# EAGLE design 2021-01-21_HALO_Main_Board-Autorouted (EAGLE 9.6.2)
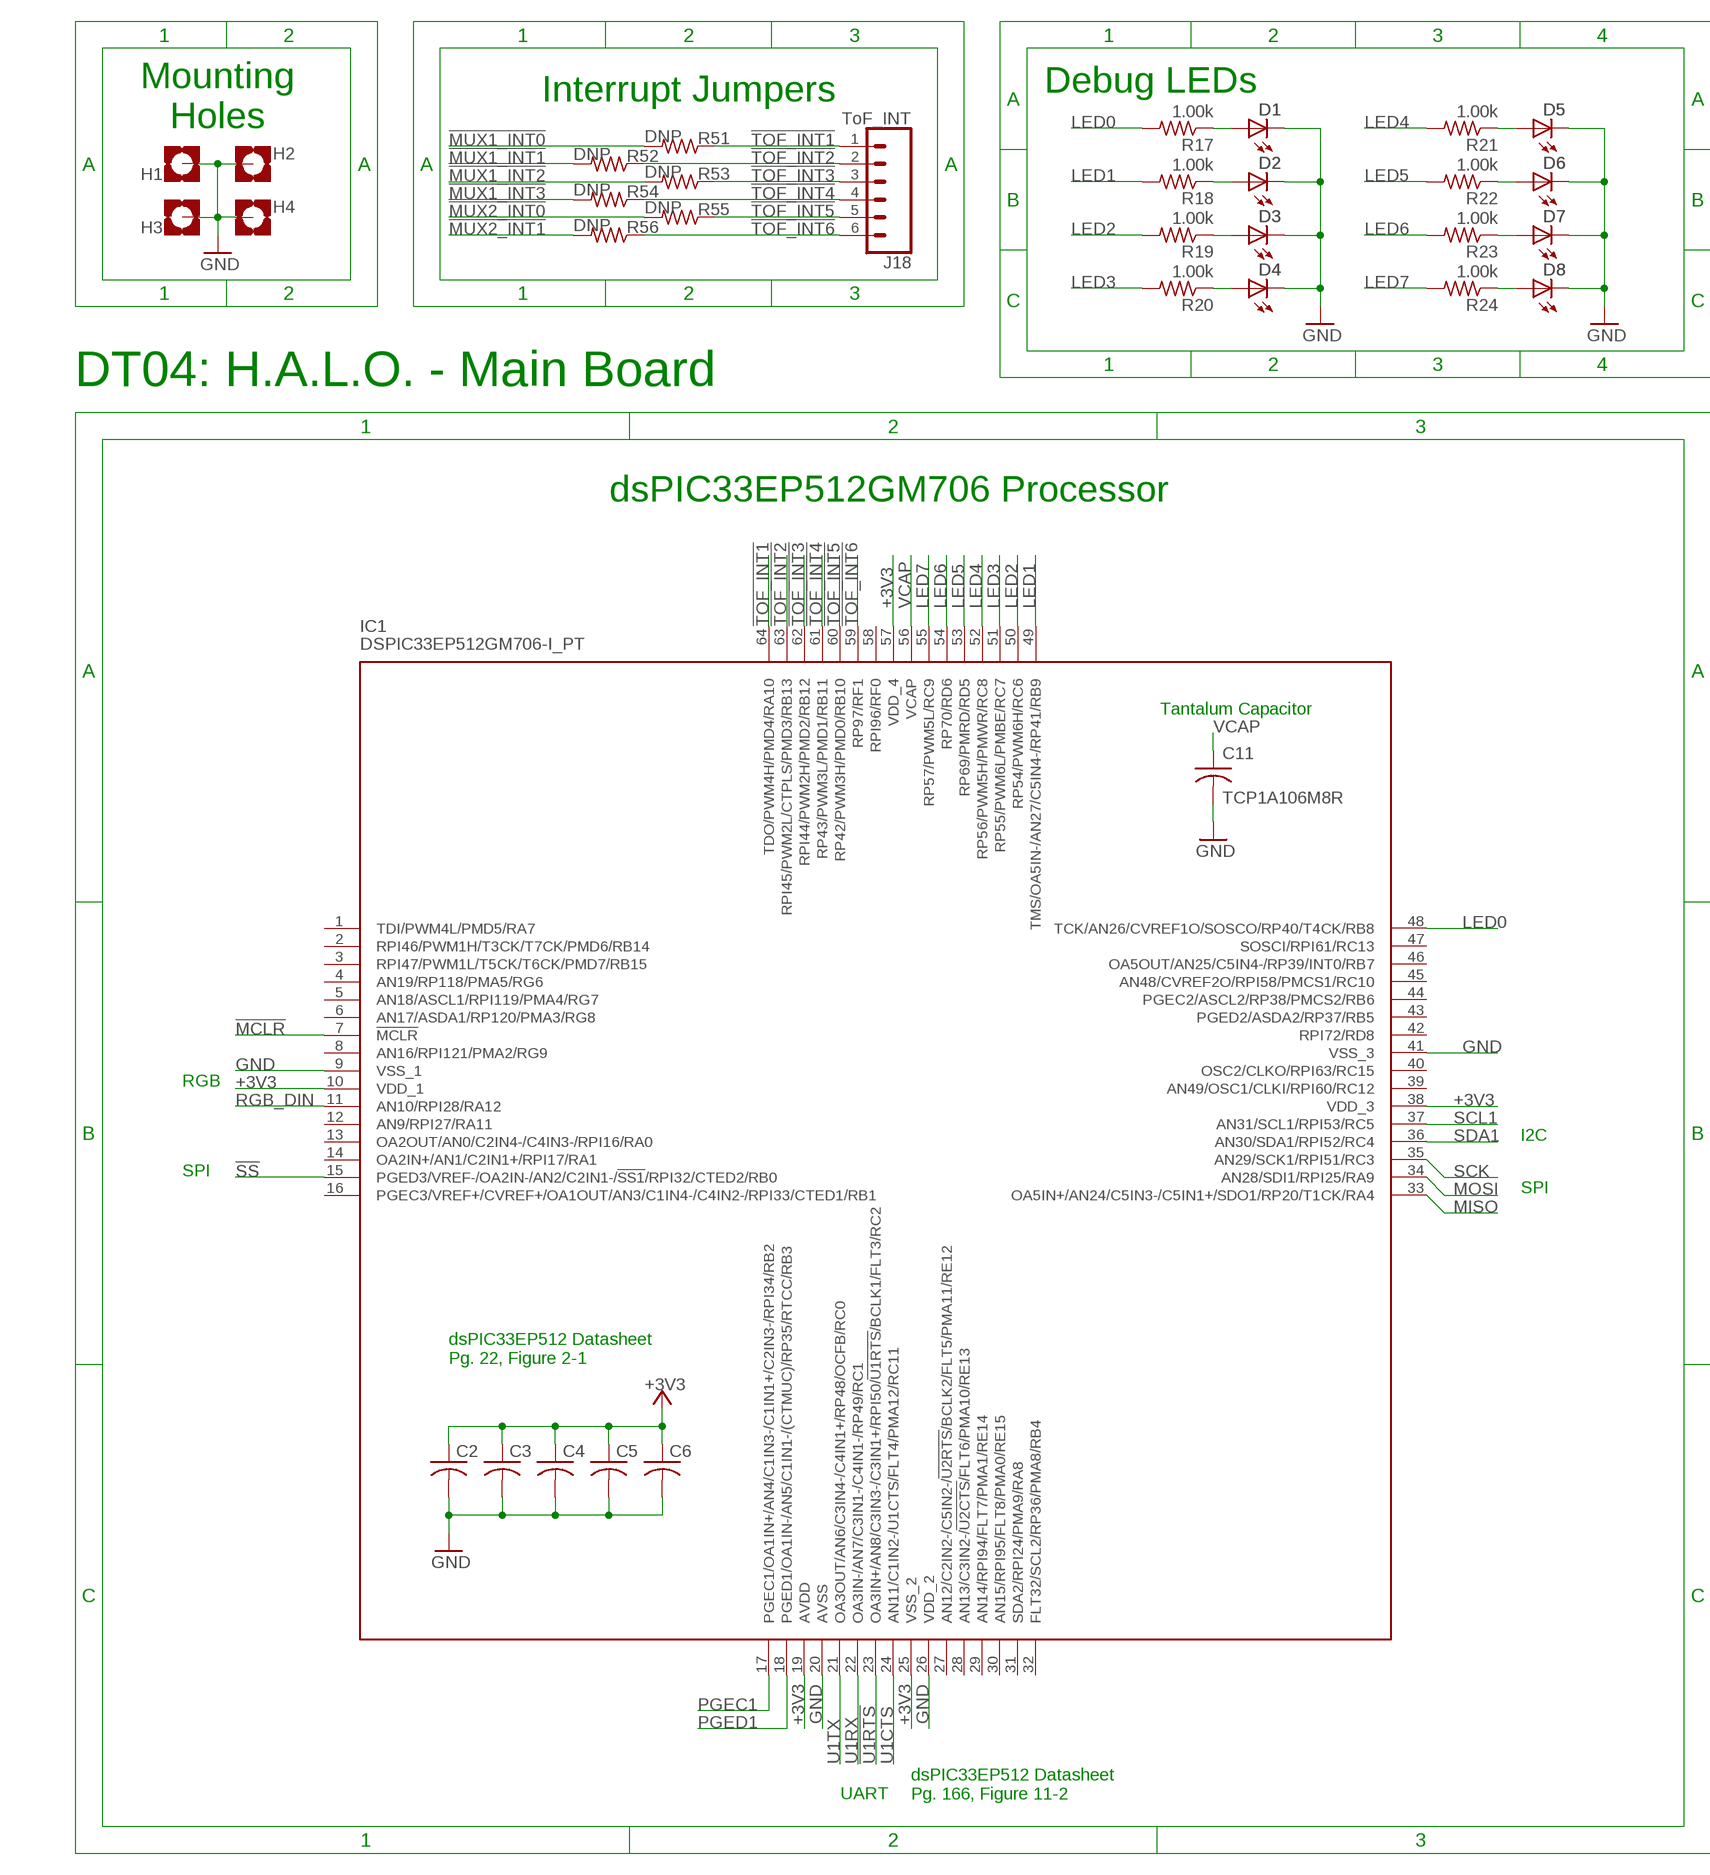
[diagram p0: schematic, sheet 1, part 1 of 2]
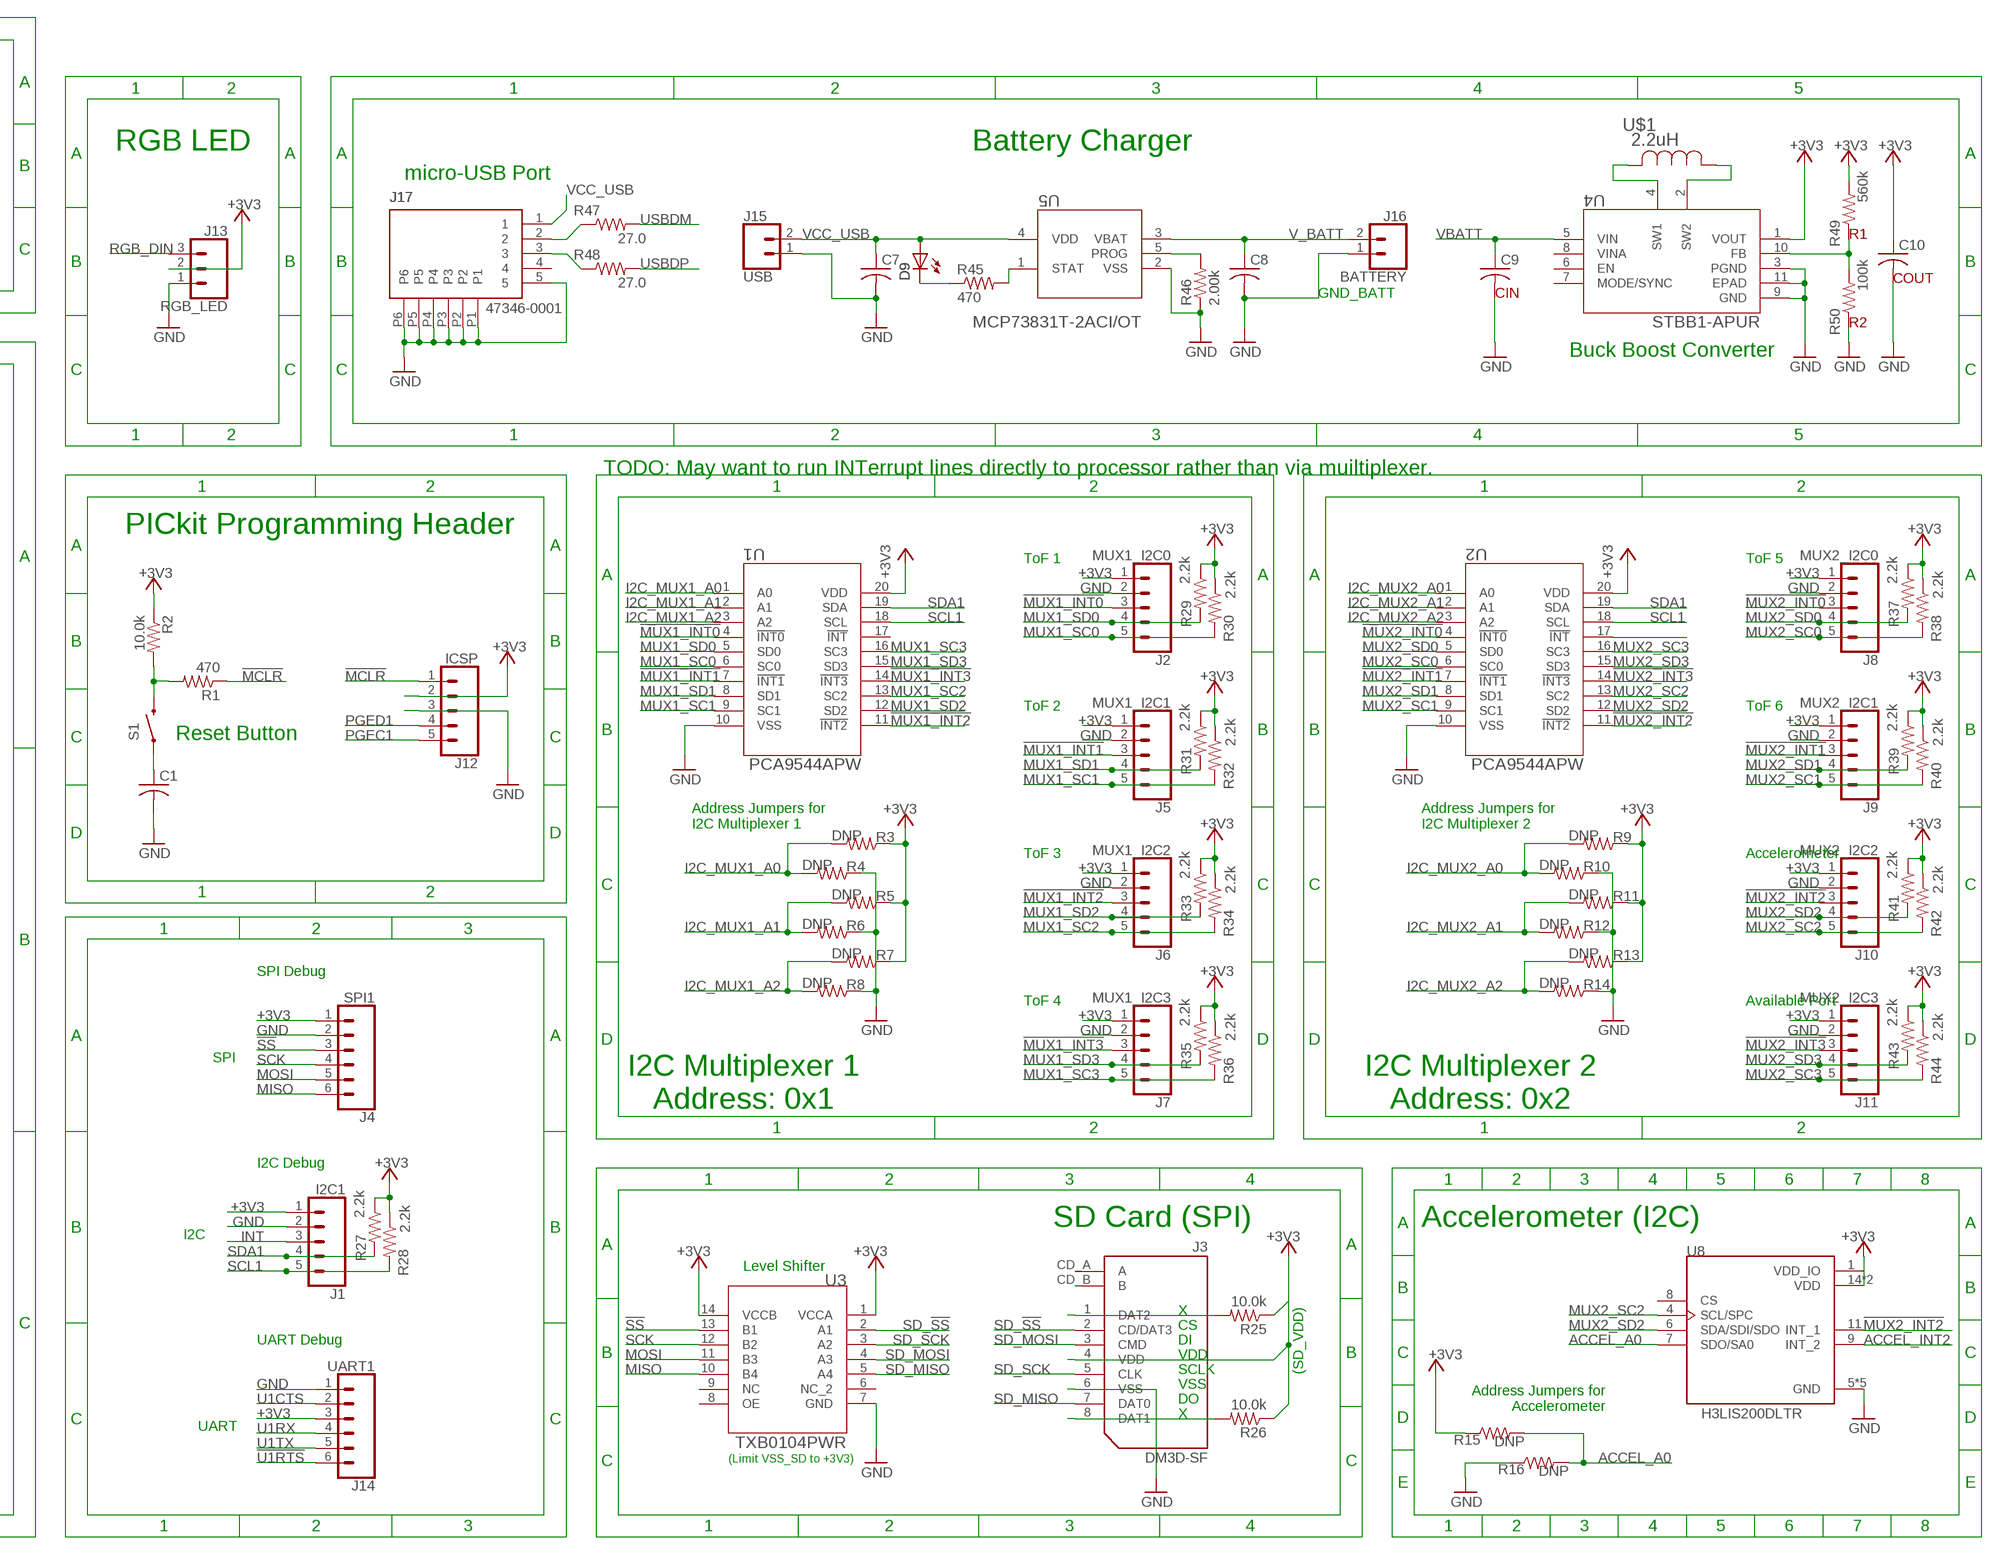
[diagram p1: schematic, sheet 1, part 2 of 2]

## Parts
C1  0.1uF  C-USC0805  [C0805]
C2  0.1uF  C-USC0805  [C0805]
C3  0.1uF  C-USC0805  [C0805]
C4  0.1uF  C-USC0805  [C0805]
C5  0.1uF  C-USC0805  [C0805]
C6  0.1uF  C-USC0805  [C0805]
C7  4.7uF  C-USC0805  [C0805]
C8  4.7uF  C-USC0805  [C0805]
C9  10uF  C-USC0805  [C0805]
C10  22uF  C-USC0805  [C0805]
C11  TCP1A106M8R  [TCP_ROM]
D1  CHIP-LED0805  [CHIP-LED0805]
D2  CHIP-LED0805  [CHIP-LED0805]
D3  CHIP-LED0805  [CHIP-LED0805]
D4  CHIP-LED0805  [CHIP-LED0805]
D5  CHIP-LED0805  [CHIP-LED0805]
D6  CHIP-LED0805  [CHIP-LED0805]
D7  CHIP-LED0805  [CHIP-LED0805]
D8  CHIP-LED0805  [CHIP-LED0805]
D9  CHIP-LED0805  [CHIP-LED0805]
H1  MOUNT-PAD-SQUARE3.0  [3,0-PAD-SQUARE]
H2  MOUNT-PAD-SQUARE3.0  [3,0-PAD-SQUARE]
H3  MOUNT-PAD-SQUARE3.0  [3,0-PAD-SQUARE]
H4  MOUNT-PAD-SQUARE3.0  [3,0-PAD-SQUARE]
IC1  DSPIC33EP512GM706-I_PT  [QFP50P1200X1200X120-64N]
J1  I2C1  CONN_05  [1X05]
J2  MUX1_I2C0  CONN_05  [1X05]
J3  DM3D-SF  AS-ITM-00047  [SD_CARD]
J4  SPI1  CONN_06SILK_FEMALE_PTH  [1X06]
J5  MUX1_I2C1  CONN_05  [1X05]
J6  MUX1_I2C2  CONN_05  [1X05]
J7  MUX1_I2C3  CONN_05  [1X05]
J8  MUX2_I2C0  CONN_05  [1X05]
J9  MUX2_I2C1  CONN_05  [1X05]
J10  MUX2_I2C2  CONN_05  [1X05]
J11  MUX2_I2C3  CONN_05  [1X05]
J12  ICSP  CONN_05  [1X05]
J13  RGB_LED  CONN_03LOCK  [1X03_LOCK]
J14  UART1  CONN_06SILK_FEMALE_PTH  [1X06]
J15  USB  CONN_02  [1X02]
J16  BATTERY  CONN_02  [1X02]
J17  47346-0001  AS-ITM-00021  [MICRO_USB]
J18  ToF_INT  CONN_06SILK_FEMALE_PTH  [1X06]
R1  470  R-US_R0805  [R0805]
R2  10.0k  R-US_R0805  [R0805]
R3  DNP  R-US_R0805  [R0805]
R4  DNP  R-US_R0805  [R0805]
R5  DNP  R-US_R0805  [R0805]
R6  DNP  R-US_R0805  [R0805]
R7  DNP  R-US_R0805  [R0805]
R8  DNP  R-US_R0805  [R0805]
R9  DNP  R-US_R0805  [R0805]
R10  DNP  R-US_R0805  [R0805]
R11  DNP  R-US_R0805  [R0805]
R12  DNP  R-US_R0805  [R0805]
R13  DNP  R-US_R0805  [R0805]
R14  DNP  R-US_R0805  [R0805]
R15  DNP  R-US_R0805  [R0805]
R16  DNP  R-US_R0805  [R0805]
R17  1.00k  R-US_R0805  [R0805]
R18  1.00k  R-US_R0805  [R0805]
R19  1.00k  R-US_R0805  [R0805]
R20  1.00k  R-US_R0805  [R0805]
R21  1.00k  R-US_R0805  [R0805]
R22  1.00k  R-US_R0805  [R0805]
R23  1.00k  R-US_R0805  [R0805]
R24  1.00k  R-US_R0805  [R0805]
R25  10.0k  R-US_R0805  [R0805]
R26  10.0k  R-US_R0805  [R0805]
R27  2.2k  R-US_R0805  [R0805]
R28  2.2k  R-US_R0805  [R0805]
R29  2.2k  R-US_R0805  [R0805]
R30  2.2k  R-US_R0805  [R0805]
R31  2.2k  R-US_R0805  [R0805]
R32  2.2k  R-US_R0805  [R0805]
R33  2.2k  R-US_R0805  [R0805]
R34  2.2k  R-US_R0805  [R0805]
R35  2.2k  R-US_R0805  [R0805]
R36  2.2k  R-US_R0805  [R0805]
R37  2.2k  R-US_R0805  [R0805]
R38  2.2k  R-US_R0805  [R0805]
R39  2.2k  R-US_R0805  [R0805]
R40  2.2k  R-US_R0805  [R0805]
R41  2.2k  R-US_R0805  [R0805]
R42  2.2k  R-US_R0805  [R0805]
R43  2.2k  R-US_R0805  [R0805]
R44  2.2k  R-US_R0805  [R0805]
R45  470  R-US_R0805  [R0805]
R46  2.00k  R-US_R0805  [R0805]
R47  27.0  R-US_R0805  [R0805]
R48  27.0  R-US_R0805  [R0805]
R49  560k  R-US_R0805  [R0805]
R50  100k  R-US_R0805  [R0805]
R51  DNP  R-US_R0805  [R0805]
R52  DNP  R-US_R0805  [R0805]
R53  DNP  R-US_R0805  [R0805]
R54  DNP  R-US_R0805  [R0805]
R55  DNP  R-US_R0805  [R0805]
R56  DNP  R-US_R0805  [R0805]
S1  SWITCH-MOMENTARY-2SMD-4  [TACTILE_SWITCH_TALL]
U1  PCA9544APW  [SOT360-1_NXP]
U2  PCA9544APW  [SOT360-1_NXP]
U3  TXB0104PWR  [PW14]
U4  STBB1-APUR  [SON_B1-APUR_STM]
U5  MCP73831T-2ACI/OT  [SOT-23-5_MC_MCH]
U8  H3LIS200DLTR  [PQFN50P300X300X100-16N]
U$1  2.2uH  IND  [IND_4028_TDK]

## Nets
!MCLR: IC1.7(!MCLR) J12.1 R1.1
!MUX1_INT0: J2.3 R51.2 U1.4(!INT0)
!MUX1_INT1: J5.3 R52.2 U1.7(!INT1)
!MUX1_INT2: J6.3 R53.2 U1.11(!INT2)
!MUX1_INT3: J7.3 R54.2 U1.14(!INT3)
!MUX2_INT0: J8.3 R55.2 U2.4(!INT0)
!MUX2_INT1: J9.3 R56.2 U2.7(!INT1)
!MUX2_INT2: J10.3 U2.11(!INT2) U8.11(INT_1)
!MUX2_INT3: J11.3 U2.14(!INT3)
!SS: IC1.15(PGED3/VREF-/OA2IN-/AN2/C2IN1-/!SS1!/RPI32/CTED2/RB0) J4.3 U3.13(B1)
!TOF_INT1: IC1.64(TDO/PWM4H/PMD4/RA10) J18.1 R51.1
!TOF_INT2: IC1.63(RPI45/PWM2L/CTPLS/PMD3/RB13) J18.2 R52.1
!TOF_INT3: IC1.62(RPI44/PWM2H/PMD2/RB12) J18.3 R53.1
!TOF_INT4: IC1.61(RP43/PWM3L/PMD1/RB11) J18.4 R54.1
!TOF_INT5: IC1.60(RP42/PWM3H/PMD0/RB10) J18.5 R55.1
!TOF_INT6: IC1.59(RP97/RF1) J18.6 R56.1
!U1RTS: IC1.23(OA3IN+/AN8/C3IN3-/C3IN1+/RPI50/!U1RTS!/BCLK1/FLT3/RC2) J14.6
+3V3: C2.1 C3.1 C4.1 C5.1 C6.1 C10.1 IC1.10(VDD_1) IC1.19(AVDD) IC1.25(VSS_2) IC1.38(VDD_3) IC1.57(VDD_4) J1.1 J2.1 J3.4(VDD) J4.1 J5.1 J6.1 J7.1 J8.1 J9.1 J10.1 J11.1 J12.2 J13.2 J14.3 R2.1 R3.1 R5.1 R7.1 R9.1 R11.1 R13.1 R15.1 R25.1 R26.1 R27.1 R28.1 R29.1 R30.1 R31.1 R32.1 R33.1 R34.1 R35.1 R36.1 R37.1 R38.1 R39.1 R40.1 R41.1 R42.1 R43.1 R44.1 R49.2 U1.20(VDD) U2.20(VDD) U3.1(VCCA) U3.14(VCCB) U4.1(VOUT) U8.1(VDD_IO) U8.14(VDD) U8.15(VDD)
ACCEL_A0: R15.2 R16.2 U8.7(SDO/SA0)
ACCEL_INT2: U8.9(INT_2)
GND: C1.2 C2.2 C3.2 C4.2 C5.2 C6.2 C7.2 C8.2 C9.2 C10.2 C11.2 D1.C D2.C D3.C D4.C D5.C D6.C D7.C D8.C H1.B3,0(MOUNT) H2.B3,0(MOUNT) H3.B3,0(MOUNT) H4.B3,0(MOUNT) IC1.9(VSS_1) IC1.20(AVSS) IC1.26(VDD_2) IC1.41(VSS_3) J1.2 J2.2 J3.6(VSS) J4.2 J5.2 J6.2 J7.2 J8.2 J9.2 J10.2 J11.2 J12.3 J13.1 J14.1 J15.1 J16.1 J17.5 J17.P1 J17.P2 J17.P3 J17.P4 J17.P5 J17.P6 R4.1 R6.1 R8.1 R10.1 R12.1 R14.1 R16.1 R46.1 R50.1 U1.10(VSS) U2.10(VSS) U3.7(GND) U4.3(PGND) U4.9(GND) U4.11(EPAD) U5.2(VSS) U8.5(GND) U8.10(GND) U8.12(GND) U8.13(GND) U8.16(GND)
I2C_MUX1_A0: R3.2 R4.2 U1.1(A0)
I2C_MUX1_A1: R5.2 R6.2 U1.2(A1)
I2C_MUX1_A2: R7.2 R8.2 U1.3(A2)
I2C_MUX2_A0: R9.2 R10.2 U2.1(A0)
I2C_MUX2_A1: R11.2 R12.2 U2.2(A1)
I2C_MUX2_A2: R13.2 R14.2 U2.3(A2)
INT: J1.3
LED0: IC1.48(TCK/AN26/CVREF1O/SOSCO/RP40/T4CK/RB8) R17.2
LED1: IC1.49(TMS/OA5IN-/AN27/C5IN4-/RP41/RB9) R18.2
LED2: IC1.50(RP54/PWM6H/RC6) R19.2
LED3: IC1.51(RP55/PWM6L/PMBE/RC7) R20.2
LED4: IC1.52(RP56/PWM5H/PMWR/RC8) R21.2
LED5: IC1.53(RP69/PMRD/RD5) R22.2
LED6: IC1.54(RP70/RD6) R23.2
LED7: IC1.55(RP57/PWM5L/RC9) R24.2
MISO: IC1.33(OA5IN+/AN24/C5IN3-/C5IN1+/SDO1/RP20/T1CK/RA4) J4.6 U3.10(B4)
MOSI: IC1.34(AN28/SDI1/RPI25/RA9) J4.5 U3.11(B3)
MUX1_SC0: J2.5 R30.2 U1.6(SC0)
MUX1_SC1: J5.5 R32.2 U1.9(SC1)
MUX1_SC2: J6.5 R34.2 U1.13(SC2)
MUX1_SC3: J7.5 R36.2 U1.16(SC3)
MUX1_SD0: J2.4 R29.2 U1.5(SD0)
MUX1_SD1: J5.4 R31.2 U1.8(SD1)
MUX1_SD2: J6.4 R33.2 U1.12(SD2)
MUX1_SD3: J7.4 R35.2 U1.15(SD3)
MUX2_SC0: J8.5 R38.2 U2.6(SC0)
MUX2_SC1: J9.5 R40.2 U2.9(SC1)
MUX2_SC2: J10.5 R42.2 U2.13(SC2) U8.4(SCL/SPC)
MUX2_SC3: J11.5 R44.2 U2.16(SC3)
MUX2_SD0: J8.4 R37.2 U2.5(SD0)
MUX2_SD1: J9.4 R39.2 U2.8(SD1)
MUX2_SD2: J10.4 R41.2 U2.12(SD2) U8.6(SDA/SDI/SDO)
MUX2_SD3: J11.4 R43.2 U2.15(SD3)
N$1: R1.2 R2.2 S1.B2
N$2: C1.1 S1.A2
N$3: J3.8(DAT1) R26.2
N$4: J3.1(DAT2) R25.2
N$5: D1.A R17.1
N$6: J17.2 R47.1
N$7: D2.A R18.1
N$8: D9.C R45.1
N$9: R49.1 R50.2 U4.10(FB)
N$10: D3.A R19.1
N$11: D4.A R20.1
N$12: D5.A R21.1
N$13: D6.A R22.1
N$14: D7.A R23.1
N$15: D8.A R24.1
N$16: R45.2 U5.1(STAT)
N$17: J17.3 R48.1
N$18: U4.4(SW1) U$1.2
N$19: R46.2 U5.5(PROG)
N$20: U4.2(SW2) U$1.1
N$25: U2.17(!INT)
PGEC1: IC1.17(PGEC1/OA1IN+/AN4/C1IN3-/C1IN1+/C2IN3-/RPI34/RB2) J12.5
PGED1: IC1.18(PGED1/OA1IN-/AN5/C1IN1-/(CTMUC)/RP35/RTCC/RB3) J12.4
RGB_DIN: IC1.11(AN10/RPI28/RA12) J13.3
SCK: IC1.35(AN29/SCK1/RPI51/RC3) J4.4 U3.12(B2)
SCL1: IC1.37(AN31/SCL1/RPI53/RC5) J1.5 R28.2 U1.18(SCL) U2.18(SCL)
SD_!SS: J3.2(CD/DAT3) U3.2(A1)
SD_MISO: J3.7(DAT0) U3.5(A4)
SD_MOSI: J3.3(CMD) U3.4(A3)
SD_SCK: J3.5(CLK) U3.3(A2)
SDA1: IC1.36(AN30/SDA1/RPI52/RC4) J1.4 R27.2 U1.19(SDA) U2.19(SDA)
U1CTS: IC1.24(AN11/C1IN2-/U1CTS/FLT4/PMA12/RC11) J14.2
U1RX: IC1.22(OA3IN-/AN7/C3IN1-/C4IN1-/RP49/RC1) J14.4
U1TX: IC1.21(OA3OUT/AN6/C3IN4-/C4IN1+/RP48/OCFB/RC0) J14.5
USBDM: R47.2
USBDP: R48.2
V_BATT: C8.1 J16.2 U5.3(VBAT)
VBATT: C9.1 U4.5(VIN)
VCAP: C11.1 IC1.56(VCAP)
VCC_USB: C7.1 D9.A J15.2 J17.1 U5.4(VDD)
Unconnected: IC1.1(TDI/PWM4L/PMD5/RA7) IC1.2(RPI46/PWM1H/T3CK/T7CK/PMD6/RB14) IC1.3(RPI47/PWM1L/T5CK/T6CK/PMD7/RB15) IC1.4(AN19/RP118/PMA5/RG6) IC1.5(AN18/ASCL1/RPI119/PMA4/RG7) IC1.6(AN17/ASDA1/RP120/PMA3/RG8) IC1.8(AN16/RPI121/PMA2/RG9) IC1.12(AN9/RPI27/RA11) IC1.13(OA2OUT/AN0/C2IN4-/C4IN3-/RPI16/RA0) IC1.14(OA2IN+/AN1/C2IN1+/RPI17/RA1) IC1.16(PGEC3/VREF+/CVREF+/OA1OUT/AN3/C1IN4-/C4IN2-/RPI33/CTED1/RB1) IC1.27(AN12/C2IN2-/C5IN2-/!U2RTS!/BCLK2/FLT5/PMA11/RE12) IC1.28(AN13/C3IN2-/!U2CTS!/FLT6/PMA10/RE13) IC1.29(AN14/RPI94/FLT7/PMA1/RE14) IC1.30(AN15/RPI95/FLT8/PMA0/RE15) IC1.31(SDA2/RPI24/PMA9/RA8) IC1.32(FLT32/SCL2/RP36/PMA8/RB4) IC1.39(AN49/OSC1/CLKI/RPI60/RC12) IC1.40(OSC2/CLKO/RPI63/RC15) IC1.42(RPI72/RD8) IC1.43(PGED2/ASDA2/RP37/RB5) IC1.44(PGEC2/ASCL2/RP38/PMCS2/RB6) IC1.45(AN48/CVREF2O/RPI58/PMCS1/RC10) IC1.46(OA5OUT/AN25/C5IN4-/RP39/INT0/RB7) IC1.47(SOSCI/RPI61/RC13) IC1.58(RPI96/RF0) J3.CD_A(A) J3.CD_B(B) J17.4 U1.17(!INT) U3.6(NC_2) U3.8(OE) U3.9(NC) U4.6(EN) U4.7(MODE/SYNC) U8.8(CS)

## Notes on the sheet
- Interrupt Jumpers | Debug LEDs
- Mounting
  Holes
- RGB LED | Battery Charger
- micro-USB Port
- R1
- COUT
- GND_BATT | CIN
- DT04: H.A.L.O. - Main Board
- R2
- Buck Boost Converter
- dsPIC33EP512GM706 Processor
- TODO: May want to run INTerrupt lines directly to processor rather than via muiltiplexer.
- PICkit Programming Header
- ToF 1 | ToF 5
- Tantalum Capacitor
- ToF 2 | ToF 6
- Reset Button
- Address Jumpers for
  I2C Multiplexer 1
- Address Jumpers for
  I2C Multiplexer 2
- ToF 3 | Accelerometer
- ┏ 
  RGB
       ┃
       ┗
- ┓ 
   I2C
  ┛
- SPI Debug
- ┏ 
  SPI
     ┗
- ToF 4 | Available Port
- ┓ 
   SPI
  ┃ 
  ┛
- ┏ 
     ┃
     ┃
  SPI
     ┃
     ┃
     ┗
- I2C Multiplexer 1
  Address: 0x1
- I2C Multiplexer 2
  Address: 0x2
- dsPIC33EP512 Datasheet
  Pg. 22, Figure 2-1
- I2C Debug
- SD Card (SPI) | Accelerometer (I2C)
- Level Shifter
- ┏ 
     ┃
  I2C
     ┃
     ┃
     ┗
- X
- CS
- UART Debug | DI
- VDD
- SCLK | (SD_VDD)
- VSS
- DO
- Address Jumpers for
  Accelerometer
- X
- (Limit VSS_SD to +3V3)
- ┏ 
        ┃
        ┃
  UART
        ┃
        ┃
        ┗
- ┗ UART┛
- dsPIC33EP512 Datasheet
  Pg. 166, Figure 11-2

## Power pins joined to a net without a drawn wire
VINA: U4.8(VINA)

## Library data of the parts
C1-C10 = rcl:C-US: CAPACITOR, American symbol
C11 = HALO_Tant_Cap_Library:TCP1A106M8R; BUILT_BY: EMA_UL_Team; MANUFACTURER_PART_NUMBER: TCP1A106M8R; SOURCELIBRARY: Rohm_2014-12-31; VENDOR: ROHM Semiconductor
D1-D9 = UA_NASA_RMC-Diodes:CHIP-LED0805
H1-H4 = holes:MOUNT-PAD-SQUARE: MOUNTING PAD, square
IC1 = SamacSys_Parts:DSPIC33EP512GM706-I_PT: Microchip DSPIC33EP512GM706-I/PT, 16bit dsPIC Microcontroller, 60MHz, 512 kB Flash, 64-Pin TQFP Source: Datasheet <http://www.microchip.com/mymicrochip/filehandler.aspx?ddocname=en561674>; ARROW_PART_NUMBER: DSPIC33EP512GM706-I/PT; ARROW_PRICE-STOCK: https://www.arrow.com/en/products/dspic33ep512gm706-ipt/microchip-technology; DESCRIPTION: Microchip DSPIC33EP512GM706-I/PT, 16bit dsPIC Microcontroller, 60MHz, 512 kB Flash, 64-Pin TQFP; HEIGHT: 1.2mm; MANUFACTURER_NAME: Microchip; MANUFACTURER_PART_NUMBER: DSPIC33EP512GM706-I/PT; MOUSER_PART_NUMBER: 579-512GM706-I/PT; MOUSER_PRICE-STOCK: https://www.mouser.com/Search/Refine.aspx?Keyword=579-512GM706-I%2FPT
J1 J2 J5-J12 = SparkFun-Connectors:CONN_05: Multi connection point. Often used as Generic Header-pin footprint for 0.1 inch spaced/style header connections On any of the 0.1 inch spaced packages, you can populate with these: Break Away Headers - Straight <https://www.sparkfun.com/products/116> (PRT-00116) Break Away Male Headers - Right Angle <https://www.sparkfun.com/products/553> (PRT-00553) Female Headers <https://www.sparkfun.com/products/115> (PRT-00115) Break Away Headers - Machine Pin <https://www.sparkfun.com/products/117> (PRT-00117) Break Away Female Headers - Swiss Machine Pin <https://www.sparkfun.com/products/743> (PRT-00743) For SCREWTERMINALS and SPRING TERMINALS visit here: Screw Terimnals on SparkFun.com <https://www.sparkfun.com/search/results?term=Screw+Terminals> (5mm/3.5mm/2.54mm spacing) This device is also useful as a general connection point to wire up your design to another part of your project. Our various solder wires solder well into these plated through hole pads. Hook-Up Wire - Assortment (Stranded, 22 AWG) <https://www.sparkfun.com/products/11375> (PRT-11375) Hook-Up Wire - Assortment (Solid Core, 22 AWG) <https://www.sparkfun.com/products/11367> (PRT-11367) View the entire wire category on our website here <https://www.sparkfun.com/categories/141> Special notes: Molex polarized connector foot print use with SKU : PRT-08231 with associated crimp pins and housings. 1MM SMD Version SKU: PRT-10208
J3 = tinycircuits:AS-ITM-00047: CONN MICRO SD R/A PUSH-PULL SMD; PARTNO: AS-ITM-00047; PNPROTATION: 270
J4 J14 J18 = SparkFun-Connectors:CONN_06: Multi connection point. Often used as Generic Header-pin footprint for 0.1 inch spaced/style header connections On any of the 0.1 inch spaced packages, you can populate with these: Break Away Headers - Straight <https://www.sparkfun.com/products/116> (PRT-00116) Break Away Male Headers - Right Angle <https://www.sparkfun.com/products/553> (PRT-00553) Female Headers <https://www.sparkfun.com/products/115> (PRT-00115) Break Away Headers - Machine Pin <https://www.sparkfun.com/products/117> (PRT-00117) Break Away Female Headers - Swiss Machine Pin <https://www.sparkfun.com/products/743> (PRT-00743) Arduino Stackable Header - 6 Pin <https://www.sparkfun.com/products/9280> (PRT-09280) For SCREWTERMINALS and SPRING TERMINALS visit here: Screw Terimnals on SparkFun.com <https://www.sparkfun.com/search/results?term=Screw+Terminals> (5mm/3.5mm/2.54mm spacing) This device is also useful as a general connection point to wire up your design to another part of your project. Our various solder wires solder well into these plated through hole pads. Hook-Up Wire - Assortment (Stranded, 22 AWG) <https://www.sparkfun.com/products/11375> (PRT-11375) Hook-Up Wire - Assortment (Solid Core, 22 AWG) <https://www.sparkfun.com/products/11367> (PRT-11367) View the entire wire category on our website here <https://www.sparkfun.com/categories/141>; PROD_ID: CONN-08437
J13 = SparkFun-Connectors:CONN_03: Multi connection point. Often used as Generic Header-pin footprint for 0.1 inch spaced/style header connections On any of the 0.1 inch spaced packages, you can populate with these: Break Away Headers - Straight <https://www.sparkfun.com/products/116> (PRT-00116) Break Away Male Headers - Right Angle <https://www.sparkfun.com/products/553> (PRT-00553) Female Headers <https://www.sparkfun.com/products/115> (PRT-00115) Break Away Headers - Machine Pin <https://www.sparkfun.com/products/117> (PRT-00117) Break Away Female Headers - Swiss Machine Pin <https://www.sparkfun.com/products/743> (PRT-00743) Stackable Header - 3 Pin (Female, 0.1") <https://www.sparkfun.com/products/13875> (PRT-13875) For SCREWTERMINALS and SPRING TERMINALS visit here: Screw Terimnals on SparkFun.com <https://www.sparkfun.com/search/results?term=Screw+Terminals> (5mm/3.5mm/2.54mm spacing) This device is also useful as a general connection point to wire up your design to another part of your project. Our various solder wires solder well into these plated through hole pads. Hook-Up Wire - Assortment (Stranded, 22 AWG) <https://www.sparkfun.com/products/11375> (PRT-11375) Hook-Up Wire - Assortment (Solid Core, 22 AWG) <https://www.sparkfun.com/products/11367> (PRT-11367) View the entire wire category on our website here <https://www.sparkfun.com/categories/141> Special notes: Molex polarized connector foot print use with SKU : PRT-08232 with associated crimp pins and housings.
J15 J16 = SparkFun-Connectors:CONN_02: Multi connection point. Often used as Generic Header-pin footprint for 0.1 inch spaced/style header connections On any of the 0.1 inch spaced packages, you can populate with these: Break Away Headers - Straight <https://www.sparkfun.com/products/116> (PRT-00116) Break Away Male Headers - Right Angle <https://www.sparkfun.com/products/553> (PRT-00553) Female Headers <https://www.sparkfun.com/products/115> (PRT-00115) Break Away Headers - Machine Pin <https://www.sparkfun.com/products/117> (PRT-00117) Break Away Female Headers - Swiss Machine Pin <https://www.sparkfun.com/products/743> (PRT-00743) For SCREWTERMINALS and SPRING TERMINALS visit here: Screw Terimnals on SparkFun.com <https://www.sparkfun.com/search/results?term=Screw+Terminals> (5mm/3.5mm/2.54mm spacing) This device is also useful as a general connection point to wire up your design to another part of your project. Our various solder wires solder well into these plated through hole pads. Hook-Up Wire - Assortment (Stranded, 22 AWG) <https://www.sparkfun.com/products/11375> (PRT-11375) Hook-Up Wire - Assortment (Solid Core, 22 AWG) <https://www.sparkfun.com/products/11367> (PRT-11367) View the entire wire category on our website here <https://www.sparkfun.com/categories/141> Special notes: Molex polarized connector foot print use with: PRT-08233 with associated crimp pins and housings. 2.54_SCREWTERM for use with PRT-10571. 3.5mm Screw Terminal footprints for PRT-08084 5mm Screw Terminal footprints for use with PRT-08432
J17 = tinycircuits:AS-ITM-00021: CONN RCPT 5POS MICRO USB R/A; PARTNO: AS-ITM-00021; PNPROTATION: 90
R1-R56 = rcl:R-US_: RESISTOR, American symbol
S1 = UA_NASA_RMC-Switches:SWITCH-MOMENTARY-2: Various NO switches- pushbuttons, reed, etc Series: PTS645; PROD_ID: SWCH-11966
U1 U2 = I2C_Multiplexer:PCA9544APW; BUILT_BY: EMA_UL_Team; MANUFACTURER_PART_NUMBER: PCA9544APW; SOURCELIBRARY: NXP_2011-11-10; VENDOR: NXP
U3 = Level_Shifter_TXB0104PWR:TXB0104PWR; DATASHEET_URL: http://www.ti.com/lit/gpn/TXB0104; DESCRIPTION: 4-Bit Bidirectional Voltage-Level Translator with Auto Direction Sensing and +/-15 kV ESD Protect; FAMILY_NAME: AUTO DIRECTION SENSING DUAL SUPPLY TRANSLATOR; GENERIC_PART_NUMBER: TXB0104; INDUSTRY_STD_PKG_TYPE: TSSOP; MANUFACTURER: Texas Instruments; MANUFACTURER_PART_NUMBER: TXB0104PWR; PACKAGE_DESIGNATOR: PW; PIN_COUNT: 14; VENDOR: Texas Instruments
U4 = HALO_Buck_Boost:STBB1-APUR; BUILT_BY: EMA_Matt; DATASHEET: https://datasheet.octopart.com/STBB1-APUR-STMicroelectronics-datasheet-10837531.pdf; MANUFACTURER_PART_NUMBER: STBB1-APUR; SOURCELIBRARY: Updates_to_database_2020-11-13; VENDOR: STMicroelectronics
U5 = HALO_Batt_Charger:MCP73831T-2ACI/OT; BUILT_BY: EMA_UL_Team; MANUFACTURER_PART_NUMBER: MCP73831T-2ACI/OT; SOURCELIBRARY: Microchip_2011-05-13; VENDOR: Microchip
U8 = H3LIS200DLTR:H3LIS200DLTR: H3LIS200DL Series 3.6 V 400 Hz Low-Power 3-Axis Digital Accelerometer -TFLGA-16L; DESCRIPTION: Accelerometer X, Y, Z Axis ±100g, ±200g 25Hz ~ 500Hz 16-TFLGA (3x3); DIGI-KEY_PART_NUMBER: 497-15698-1-ND; MF: STMicroelectronics; MP: H3LIS200DLTR; PACKAGE: TFLGA-16 STMicroelectronics; PURCHASE-URL: https://pricing.snapeda.com/search/part/H3LIS200DLTR/?ref=eda
U$1 = HALO_L_Buck_Boost:IND

## Board
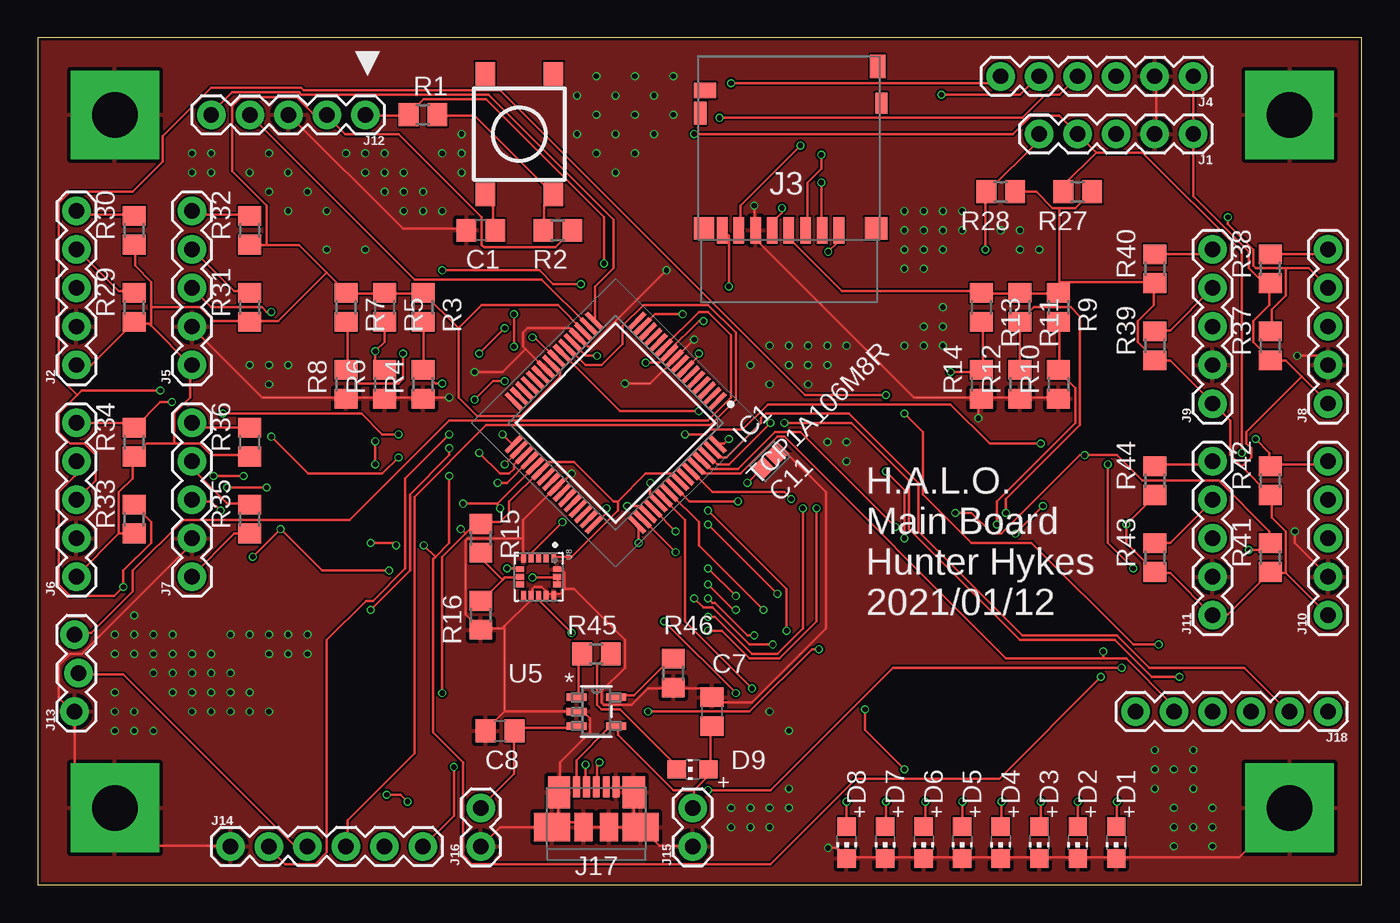
[diagram p2: board, top side]
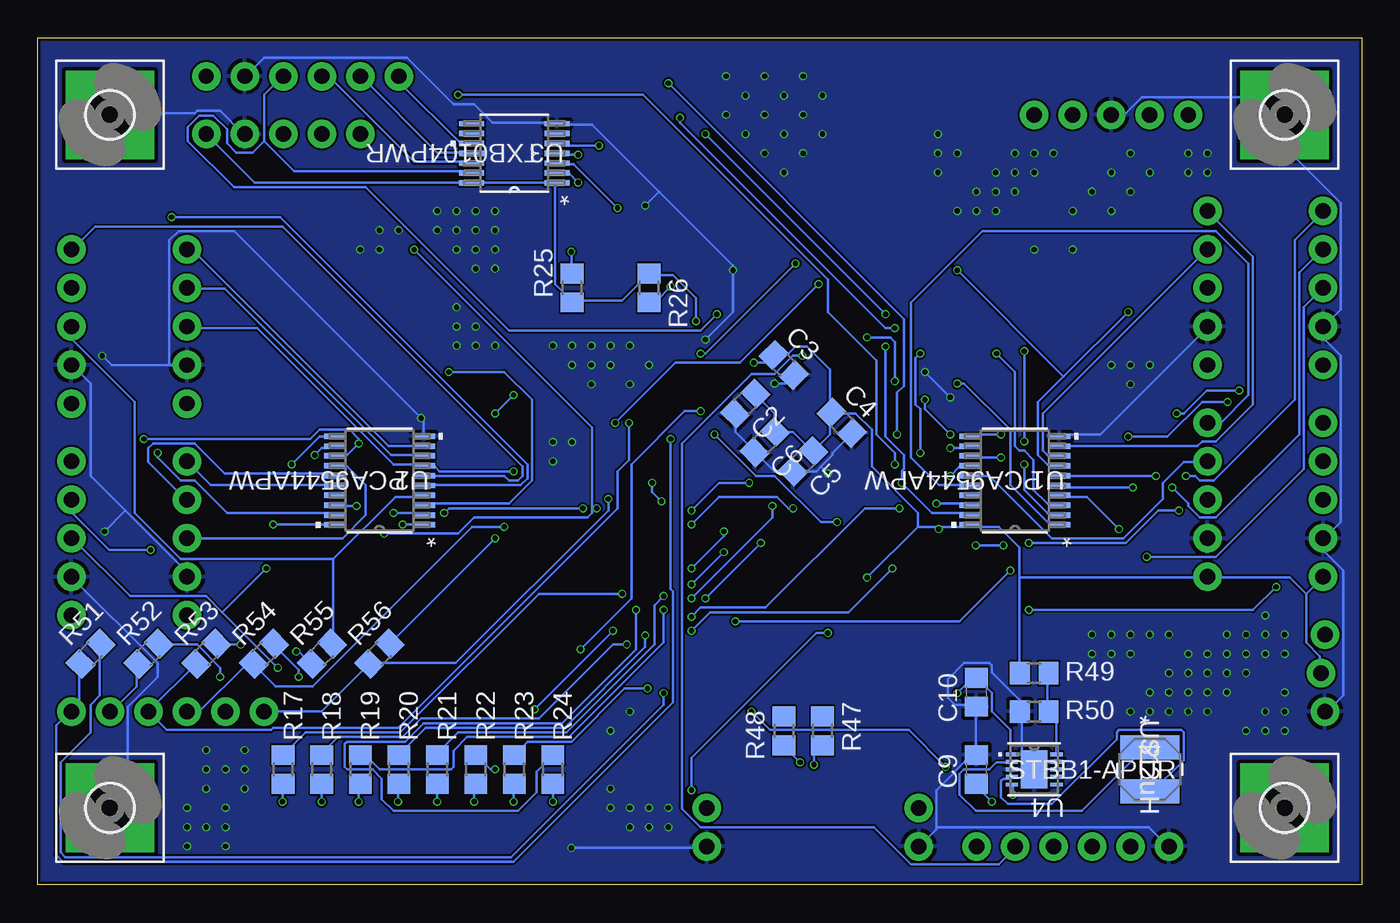
[diagram p3: board, bottom side, seen from below]

Size 87.3 x 55.87 mm. Coordinates in mm from the lower left corner, seen from the top.
Outline: 0,0 87.3,0 87.3,55.87 0,55.87 0,0
Copper layers (1*16): Top 0.035559375mm / dielectric 1.6mm / Bottom 0.035559375mm
Design rules "jlcpcb2layer": minimum track width 5mil, minimum drill 12mil, track to track 5mil, track to pad 5mil, pad to pad 5mil, via to via 5mil, smd to smd 5mil, copper to edge 8mil, drill to drill 6mil, minimum pad ring 5mil, minimum via ring 3mil, stop-mask expansion 2.5mil, vias tented up to drill 0mil, thermal gap 10mil

### Footprints (pad centres in the part's own frame; a part is rotated, then mirrored left to right if it is on the bottom)
C0805 = smd 1.3 x 1.5: 1 -0.95,0; 2 0.95,0
TCP_ROM = smd 1.167 x 1.092: 1 -0.674,0; 2 0.674,0
CHIP-LED0805 = smd 1.2 x 1.2: A 0,-1.05; C 0,1.05
3,0-PAD-SQUARE = drill 3 pad 5.842 square: B3,0 0,0
QFP50P1200X1200X120-64N = smd 1.475 x 0.3: 1 -5.738,3.75; 2 -5.738,3.25; 3 -5.738,2.75; 4 -5.738,2.25; 5 -5.738,1.75; 6 -5.738,1.25; 7 -5.738,0.75; 8 -5.738,0.25; 9 -5.738,-0.25; 10 -5.738,-0.75; 11 -5.738,-1.25; 12 -5.738,-1.75; 13 -5.738,-2.25; 14 -5.738,-2.75; 15 -5.738,-3.25; 16 -5.738,-3.75; 33 5.738,-3.75; 34 5.738,-3.25; 35 5.738,-2.75; 36 5.738,-2.25; 37 5.738,-1.75; 38 5.738,-1.25; 39 5.738,-0.75; 40 5.738,-0.25; 41 5.738,0.25; 42 5.738,0.75; 43 5.738,1.25; 44 5.738,1.75; 45 5.738,2.25; 46 5.738,2.75; 47 5.738,3.25; 48 5.738,3.75 | smd 0.3 x 1.475: 17 -3.75,-5.738; 18 -3.25,-5.738; 19 -2.75,-5.738; 20 -2.25,-5.738; 21 -1.75,-5.738; 22 -1.25,-5.738; 23 -0.75,-5.738; 24 -0.25,-5.738; 25 0.25,-5.738; 26 0.75,-5.738; 27 1.25,-5.738; 28 1.75,-5.738; 29 2.25,-5.738; 30 2.75,-5.738; 31 3.25,-5.738; 32 3.75,-5.738; 49 3.75,5.738; 50 3.25,5.738; 51 2.75,5.738; 52 2.25,5.738; 53 1.75,5.738; 54 1.25,5.738; 55 0.75,5.738; 56 0.25,5.738; 57 -0.25,5.738; 58 -0.75,5.738; 59 -1.25,5.738; 60 -1.75,5.738; 61 -2.25,5.738; 62 -2.75,5.738; 63 -3.25,5.738; 64 -3.75,5.738
1X05 = drill 1.016 pad 1.88: 1 0,0; 2 2.54,0; 3 5.08,0; 4 7.62,0; 5 10.16,0
SD_CARD = smd 0.7 x 1.75: 1 3.3,0; 2 2.2,0; 3 1.1,0; 4 0,0; 5 -1.1,0; 6 -2.2,0; 7 -3.3,0; 8 -4.4,0 | smd 1.3 x 1.5: 9 -5.6,0.125 | smd 1.5 x 1.5: 10 5.75,0.125 | smd 0.8 x 1.5: 11 -5.85,7.725 | smd 0.8 x 1.4: 13 6.1,8.375 | smd 1 x 1.55: CD_A 5.85,10.8 | smd 1.45 x 1: CD_B -5.525,9.225
1X06 = drill 1.016 pad 1.88: 1 0,0; 2 2.54,0; 3 5.08,0; 4 7.62,0; 5 10.16,0; 6 12.7,0
1X03_LOCK = drill 1.016 pad 1.88: 1 0,0.127; 2 2.54,-0.127; 3 5.08,0.127
1X02 = drill 1.016 pad 1.88: 1 0,0; 2 2.54,0
MICRO_USB = smd 1.38 x 0.45: 1 2.66,1.3; 2 2.66,0.65; 3 2.66,0; 4 2.66,-0.65; 5 2.66,-1.3 | smd 2.1 x 1.475: P1 2.3,-2.462; P2 2.3,2.462 | smd 1.9 x 2.375: P3 0,2.913; P4 0,-2.913 | smd 1.9 x 1.175: P5 0,0.838; P6 0,-0.838
R0805 = smd 1.3 x 1.5: 1 -0.95,0; 2 0.95,0
TACTILE_SWITCH_TALL = smd 1.55 x 1.3: A1 -3.975,-2.25; A2 3.975,-2.25; B1 -3.975,2.25; B2 3.975,2.25
SOT360-1_NXP = smd 1.473 x 0.356: 1 -2.921,2.925; 2 -2.921,2.275; 3 -2.921,1.625; 4 -2.921,0.975; 5 -2.921,0.325; 6 -2.921,-0.325; 7 -2.921,-0.975; 8 -2.921,-1.625; 9 -2.921,-2.275; 10 -2.921,-2.925; 11 2.921,-2.925; 12 2.921,-2.275; 13 2.921,-1.625; 14 2.921,-0.975; 15 2.921,-0.325; 16 2.921,0.325; 17 2.921,0.975; 18 2.921,1.625; 19 2.921,2.275; 20 2.921,2.925
PW14 = smd 1.676 x 0.356: 1 -2.819,1.95; 2 -2.819,1.3; 3 -2.819,0.65; 4 -2.819,0; 5 -2.819,-0.65; 6 -2.819,-1.3; 7 -2.819,-1.95; 8 2.819,-1.95; 9 2.819,-1.3; 10 2.819,-0.65; 11 2.819,0; 12 2.819,0.65; 13 2.819,1.3; 14 2.819,1.95
SON_B1-APUR_STM = smd 0.813 x 0.254: 1 -1.473,1; 2 -1.473,0.5; 3 -1.473,0; 4 -1.473,-0.5; 5 -1.473,-1; 6 1.473,-1; 7 1.473,-0.5; 8 1.473,0; 9 1.473,0.5; 10 1.473,1 | smd 1.753 x 2.489: 11 0,0
SOT-23-5_MC_MCH = smd 1.321 x 0.508: 1 -1.295,0.95; 2 -1.295,0; 3 -1.295,-0.95; 4 1.295,-0.95; 5 1.295,0.95
PQFN50P300X300X100-16N = smd 0.53 x 0.35: 1 -1.22,1; 2 -1.22,0.5; 3 -1.22,0; 4 -1.22,-0.5; 5 -1.22,-1; 9 1.22,-1; 10 1.22,-0.5; 11 1.22,0; 12 1.22,0.5; 13 1.22,1 | smd 0.35 x 0.53: 6 -0.5,-1.22; 7 0,-1.22; 8 0.5,-1.22; 14 0.5,1.22; 15 0,1.22; 16 -0.5,1.22
IND_4028_TDK = smd 1.6 x 3.9: 1 -1.45,0; 2 1.45,0

### Placement (x,y rotation side)
C1  29.21,43.18 180 top
C2  40.64,31.75 225 bottom
C3  38.1,34.29 315 bottom
C4  34.29,30.48 315 bottom
C5  36.83,27.94 225 bottom
C6  39.37,29.21 225 bottom
C7  44.45,11.43 90 top
C8  30.48,10.16 180 top
C9  25.4,7.62 90 bottom
C10  25.4,12.7 270 bottom
C11  48.26,27.94 45 top
D1  71.12,2.79 180 top
D2  68.58,2.79 180 top
D3  66.04,2.79 180 top
D4  63.5,2.79 180 top
D5  60.96,2.79 180 top
D6  58.42,2.79 180 top
D7  55.88,2.79 180 top
D8  53.34,2.79 180 top
D9  43.18,7.62 90 top
H1  5.08,50.8 0 bottom
H2  82.55,50.8 0 bottom
H3  5.08,5.08 0 bottom
H4  82.55,5.08 0 bottom
IC1  38.1,30.48 225 top
J1  76.2,49.53 180 top
J2  2.54,34.29 90 top
J3  49.53,43.18 0 top
J4  76.2,53.34 180 top
J5  10.16,34.29 90 top
J6  2.54,20.32 90 top
J7  10.16,20.32 90 top
J8  85.09,31.75 90 top
J9  77.47,31.75 90 top
J10  85.09,17.78 90 top
J11  77.47,17.78 90 top
J12  21.59,50.8 180 top
J13  2.54,11.43 90 top
J14  12.7,2.54 0 top
J15  43.18,2.54 90 top
J16  29.21,2.54 90 top
J17  36.83,3.81 90 top
J18  85.09,11.43 180 top
R1  25.4,50.8 0 top
R2  34.29,43.18 180 top
R3  25.4,38.1 270 top
R4  25.4,33.02 90 top
R5  22.86,38.1 270 top
R6  22.86,33.02 90 top
R7  20.32,38.1 270 top
R8  20.32,33.02 90 top
R9  67.31,38.1 270 top
R10  67.31,33.02 90 top
R11  64.77,38.1 270 top
R12  64.77,33.02 90 top
R13  62.23,38.1 270 top
R14  62.23,33.02 90 top
R15  29.21,22.86 270 top
R16  29.21,17.78 90 top
R17  71.12,7.62 90 bottom
R18  68.58,7.62 90 bottom
R19  66.04,7.62 90 bottom
R20  63.5,7.62 90 bottom
R21  60.96,7.62 90 bottom
R22  58.42,7.62 90 bottom
R23  55.88,7.62 90 bottom
R24  53.34,7.62 90 bottom
R25  52.07,39.37 90 bottom
R26  46.99,39.37 270 bottom
R27  68.58,45.72 180 top
R28  63.5,45.72 180 top
R29  6.35,38.1 90 top
R30  6.35,43.18 90 top
R31  13.97,38.1 90 top
R32  13.97,43.18 90 top
R33  6.35,24.13 90 top
R34  6.35,29.21 90 top
R35  13.97,24.13 90 top
R36  13.97,29.21 90 top
R37  81.28,35.56 90 top
R38  81.28,40.64 90 top
R39  73.66,35.56 90 top
R40  73.66,40.64 90 top
R41  81.28,21.59 90 top
R42  81.28,26.67 90 top
R43  73.66,21.59 90 top
R44  73.66,26.67 90 top
R45  36.83,15.24 180 top
R46  41.91,13.97 90 top
R47  35.56,10.16 90 bottom
R48  38.1,10.16 90 bottom
R49  21.59,13.97 180 bottom
R50  21.59,11.43 0 bottom
R51  83.82,15.24 45 bottom
R52  80.01,15.24 45 bottom
R53  76.2,15.24 45 bottom
R54  72.39,15.24 45 bottom
R55  68.58,15.24 45 bottom
R56  64.77,15.24 45 bottom
S1  31.75,49.53 270 top
U1  22.86,26.67 180 bottom
U2  64.77,26.67 180 bottom
U3  55.88,48.26 180 bottom
U4  21.59,7.62 0 bottom
U5  36.83,11.43 0 top
U8  33.02,20.32 270 top
U$1  13.97,7.62 270 bottom

### Tracks (layer width: path | path; a pad name or v marks a point on that pad's centre or on a via)
!MCLR  (via drill 0.35)
  Top 0.152: v43.59,35.05 43.59,34.9 42.82,34.14 IC1.7 | v37.34,41 37.34,44.04 29.57,51.82 25.45,51.82 24.54,50.9 R1.1 24.38,50.75 21.64,50.75 J12.1
  Bottom 0.152: v43.59,35.05 43.28,35.05 v37.34,41
!MUX1_INT0  (via drill 0.35)
  Top 0.152: v14.17,21.64 v16,23.47 18.75,20.73 v23.16,20.73 | v41.3,17.37 v46.02,12.65
  Bottom 0.152: v16,23.47 18.14,25.6 19.81,25.6 U1.4 | v14.17,21.64 9.6,21.64 3.81,27.43 3.81,38.1 J2.3 | v46.02,12.65 46.02,11.89 56.08,1.83 85.5,1.83 85.8,2.13 85.8,8.08 83.82,10.06 83.82,11.89 83.21,12.5 83.21,15.85 R51.2 | v41.3,17.37 26.52,17.37 v23.16,20.73
!MUX1_INT1  (via drill 0.35)
  Top 0.152: v15.39,37.8 15.09,37.8 14.78,38.1 11.43,38.1 J5.3 | v75.29,13.72 73.46,13.72 71.02,16.15 64.77,16.15 57.45,23.47 57.45,26.67 53.65,30.48 v49.23,30.48 | v35.81,39.62 33.98,39.62 33.07,40.54 v26.67,40.54
  Bottom 0.152: v15.39,37.8 19.66,33.53 | 19.66,33.53 21.34,31.85 21.34,28.35 20.73,27.74 19.96,27.74 U1.7 | v75.29,13.72 75.29,14.33 76.81,15.85 79.25,15.85 R52.2 | v49.23,30.48 45.26,34.44 41,34.44 v35.81,39.62 | 19.66,33.53 v26.67,40.54
!MUX1_INT2  (via drill 0.35)
  Top 0.152: v23.77,29.72 22.71,29.72 21.34,31.09 v12.19,31.09 | v8.08,32.61 2.9,32.61 2.59,32.31 | 2.59,32.31 1.37,31.09 1.37,29.87 2.13,29.11 3.05,29.11 3.81,28.35 3.81,26.67 J6.3 | v73.91,15.85 72.24,15.85 65.53,22.55 61.57,22.55 58.37,25.76 58.37,29.87 v57.15,31.09 | v55.93,32.31 50.6,32.31 30.48,52.43 17.53,52.43 17.37,52.58 11.43,52.58 8.23,49.38 8.23,47.7 6.25,45.72 2.13,45.72 1.37,44.96 1.37,33.53 2.59,32.31
  Bottom 0.152: v23.77,29.72 25.76,29.72 U1.11 | v12.19,31.09 11.73,31.09 10.21,32.61 v8.08,32.61 | v73.91,15.85 75.44,15.85 R53.2 | v55.93,32.31 v57.15,31.09
!MUX1_INT3  (via drill 0.35)
  Top 0.152: v27.13,26.98 27.13,22.55 26.21,21.64 | 26.21,21.64 26.06,21.49 26.06,10.06 28.04,8.08 28.04,1.98 28.65,1.37 48.31,1.37 53.95,7.01 63.4,7.01 v70.1,13.72 | v12.04,24.69 11.43,25.3 10.21,25.3 J7.3 | v21.95,22.55 23.47,22.55 v23.62,22.4 | 26.21,21.64 v25.45,22.4
  Bottom 0.152: v27.13,26.98 26.52,27.58 25.91,27.58 U1.14 | v70.1,13.72 70.1,14.17 71.78,15.85 R54.2 | v12.04,24.69 13.41,24.69 15.54,22.55 v21.95,22.55 | v25.45,22.4 v23.62,22.4
!MUX2_INT0
  Bottom 0.152: 67.82,21.49 63.7,25.6 61.87,25.6 U2.4 | 67.82,21.49 67.82,16 R55.2 | 67.82,21.49 77.88,21.49 80.92,24.54 80.92,31.85 85.04,35.97 85.04,36.73 J8.3
!MUX2_INT1  (via drill 0.35)
  Top 0.152: v57.15,22.86 57.15,26.06 v55.93,27.28
  Bottom 0.152: J9.3 77.42,36.73 72.85,36.73 63.86,27.74 61.87,27.74 U2.7 61.72,27.58 61.11,27.58 60.81,27.28 v55.93,27.28 | v57.15,22.86 R56.2
!MUX2_INT2  (via drill 0.35)
  Top 0.152: v35.2,16.61 33.07,18.75 33.07,19.05 U8.11 | v44.2,6.25 48.31,6.25 56.39,14.33 v71.48,14.33 | v70.56,27.74 70.56,22.55 v72.24,20.88
  Bottom 0.152: v35.2,16.61 35.97,16.61 44.2,8.38 v44.2,6.25 | 75.13,17.98 76.2,19.05 81.23,19.05 85.04,22.86 J10.3 | 75.13,17.98 v71.48,14.33 | v70.56,27.74 68.73,29.57 67.82,29.57 U2.11 | 75.13,17.98 v72.24,20.88
!MUX2_INT3
  Bottom 0.152: J11.3 67.21,22.86 65.68,24.38 65.68,26.36 66.9,27.58 67.67,27.58 U2.14
!SS  (via drill 0.35)
  Top 0.152: v42.52,37.64 40.69,37.64 39.93,36.88 IC1.15
  Bottom 0.152: v42.52,37.64 43.59,36.58 56.24,36.58 65.68,46.02 74.37,46.02 77.42,49.07 77.42,49.99 76.66,50.75 75.74,50.75 74.83,49.84 74.83,48.92 74.22,48.31 73.15,48.31 72.39,49.07 | 72.39,49.07 72.39,52.12 71.17,53.34 J4.3 | 72.39,49.07 70.41,47.09 58.83,47.09 U3.13
!TOF_INT1  (via drill 0.35)
  Top 0.152: v45.57,29.41 45.26,29.11 44.96,29.11 IC1.64
  Bottom 0.152: v45.57,29.41 45.57,19.51 45.41,19.36 45.41,12.04 55.93,1.52 85.65,1.52 86.11,1.98 86.11,10.52 85.19,11.43 J18.1 85.04,11.43 84.58,11.89 84.58,14.48 R51.1
!TOF_INT2
  Top 0.152: IC1.63 44.5,28.65 44.96,28.19 45.41,28.19 47.7,30.48 47.7,30.79 48.01,31.09 53.49,31.09 58.06,26.52 58.06,23.32 64.92,16.46 71.17,16.46 73.3,14.33 79.55,14.33 82.45,11.43 J18.2
  Bottom 0.152: R52.1 80.77,14.48 80.77,13.11 82.45,11.43 J18.2
!TOF_INT3  (via drill 0.35)
  Top 0.152: v48.31,30.48 45.57,27.74 44.81,27.74 44.2,28.35 IC1.62
  Bottom 0.152: v48.31,30.48 48.31,28.04 49.07,27.28 49.07,24.84 63.55,10.36 71.78,10.36 71.93,10.21 78.79,10.21 J18.3 R53.1
!TOF_INT4  (via drill 0.35)
  Top 0.152: v56.54,23.62 50.29,29.87 48.62,29.87 46.18,27.43 44.35,27.43 43.89,27.89 IC1.61
  Bottom 0.152: v56.54,23.62 58.67,23.62 69.19,13.11 71.63,13.11 73,14.48 R54.1 73.15,14.48 73.61,14.48 76.66,11.43 J18.4
!TOF_INT5  (via drill 0.35)
  Top 0.152: 70.26,14.94 71.78,14.94 74.83,11.89 74.83,11.43 J18.5 | 70.26,14.94 63.86,14.94 49.23,29.57 48.77,29.57 46.33,27.13 43.89,27.13 43.43,27.58 IC1.60 | 70.26,14.94 v70.26,15.39
  Bottom 0.152: v70.26,15.39 70.1,15.39 69.34,14.63 R55.1
!TOF_INT6  (via drill 0.35)
  Top 0.152: v49.68,25.45 49.23,25.91 44.5,25.91 43.13,27.28 IC1.59
  Bottom 0.152: v49.68,25.45 49.68,24.69 59.74,14.63 65.38,14.63 R56.1 68.58,11.43 J18.6
!U1RTS  (via drill 0.35)
  Top 0.152: v43.59,31.24 38.41,31.24 34.59,35.05 IC1.23 | v51.51,15.54 51.05,15.54 46.94,11.43 v40.23,11.43 | v27.43,7.77 27.43,4.57 J14.6
  Bottom 0.152: v43.59,31.24 44.65,31.24 48.16,27.74 48.16,18.9 v51.51,15.54 | v40.23,11.43 39.01,10.21 29.87,10.21 v27.43,7.77
+3V3  (via drill 0.35)
  Top 0.152: J4.1 J1.1 76.2,45.41 79.86,41.76 79.86,40.69 80.77,39.78 81.23,39.78 R38.1 81.23,39.62 81.23,38.25 80.16,37.19 80.16,35.81 81.23,34.75 R37.1 81.38,34.59 82.3,34.59 83.36,33.53 | 83.36,33.53 85.04,31.85 J8.1 | R44.1 73.61,25.6 v71.78,23.77 71.78,22.55 73.61,20.73 R43.1 73.76,20.57 74.68,20.57 J11.1 77.57,17.83 78.49,17.83 81.23,20.57 R41.1 81.38,20.57 82.3,20.57 | J10.1 82.3,20.57 | 82.3,20.57 82.3,23.32 81.38,24.23 81.38,25.6 R42.1 81.23,25.76 79.4,27.58 | R28.1 65.84,45.72 66.9,44.65 67.36,44.65 | 67.36,44.65 68.43,44.65 69.49,45.72 R27.1 | 64.77,39.01 62.33,39.01 R13.1 62.18,39.17 53.03,39.17 49.53,42.67 J3.4 | 64.77,39.01 67.21,39.01 R9.1 67.36,39.17 67.36,39.78 | 64.77,39.01 R11.1 | 67.36,39.78 67.36,44.65 | 67.36,39.78 73.61,39.78 R40.1 73.61,39.62 73.61,38.25 72.54,37.19 72.54,35.81 73.61,34.75 R39.1 73.76,34.59 74.68,34.59 77.42,31.85 J9.1 77.57,31.7 78.64,30.63 78.64,28.35 79.4,27.58 | 83.36,33.53 79.7,29.87 79.7,29.11 80.01,28.8 80.01,28.19 79.4,27.58 | 38.25,25.3 38.25,24.69 35.2,21.64 34.14,21.64 U8.1 | 38.25,25.3 40.08,27.13 41.76,27.13 42.22,26.67 IC1.57 | v26.67,12.65 26.67,21.64 28.19,23.16 | 28.19,23.16 28.8,23.77 29.11,23.77 R15.1 29.26,23.93 30.48,23.93 31.09,24.54 31.09,25.3 33.07,27.28 IC1.38 33.22,27.43 33.68,27.89 35.36,27.89 37.95,25.3 38.25,25.3 | v40.08,34.44 41,34.44 41.6,35.05 IC1.10 41.6,35.2 43.59,37.19 v43.89,37.19 | U8.14 34.29,19.96 34.29,20.27 U8.15 34.14,20.27 v32.61,20.27 | v27.89,23.47 28.19,23.16 | R2.1 35.2,43.13 34.14,42.06 29.41,42.06 29.26,42.22 29.26,44.04 23.77,49.53 20.27,49.53 19.05,50.75 J12.2 19.05,50.9 18.14,50.9 17.07,51.97 13.41,51.97 12.8,51.36 12.8,47.09 15.09,44.81 15.09,42.22
  Top 0.152: 22.86,39.01 20.42,39.01 R7.1 20.27,39.17 19.05,40.39 | 15.09,42.22 17.22,42.22 19.05,40.39 | 15.09,42.22 14.02,42.22 R32.1 | 27.74,36.73 27.74,32.16 28.96,30.94 31.85,30.94 34.44,33.53 34.44,33.83 33.98,34.29 IC1.25 | 27.74,36.73 25.45,39.01 R3.1 25.3,39.01 22.86,39.01 | 27.74,36.73 29.26,38.25 34.29,38.25 35.97,36.58 IC1.19 | 22.86,39.01 R5.1 | 10.06,34.29 7.47,36.88 | 7.47,36.88 7.32,37.03 6.4,37.03 R29.1 6.25,37.03 3.5,34.29 J2.1 | 7.47,36.88 7.47,38.1 | 7.47,38.1 7.47,39.78 6.4,40.84 6.4,42.22 R30.1 | 7.47,38.1 10.67,38.1 11.58,37.19 13.87,37.19 R31.1 14.02,37.19 15.85,37.19 19.05,40.39 | R35.1 13.87,23.16 12.95,23.16 10.21,20.42 J7.1 | 5.33,23.16 6.25,23.16 R33.1 | 5.33,23.16 2.59,20.42 J6.1 | 5.33,23.16 5.33,25.91 6.25,26.82 6.25,28.19 R34.1 6.4,28.35 7.16,29.11 8.99,29.11 | 8.99,29.11 10.67,29.11 11.43,28.35 13.87,28.35 R36.1 | J14.3 17.68,2.59 16.92,2.59 5.64,13.87 2.74,13.87 J13.2 | 10.06,34.29 10.06,32.16 8.99,31.09 8.99,29.11 | 10.06,34.29 J5.1
  Bottom 0.152: J1.1 73,46.33 58.83,46.33 U3.14 58.67,46.33 53.19,46.33 U3.1 53.19,46.18 53.19,39.62 52.12,38.56 R25.1 51.97,38.56 48.77,38.56 47.09,40.23 R26.1 46.94,40.23 45.41,40.23 43.89,38.71 v43.89,37.19 | v71.78,23.77 67.82,23.77 U2.20 | U4.1 23.16,8.69 23.16,10.21 24.38,11.43 24.38,12.65 25.3,13.56 C10.1 25.45,13.56 25.76,13.56 v26.67,12.65 | C2.1 39.93,32.31 38.71,31.09 38.71,30.02 C6.1 38.56,29.87 37.49,29.87 36.27,28.65 C5.1 35.05,29.72 35.05,31.09 C4.1 | v40.08,34.44 39.32,34.44 38.86,34.9 C3.1 38.71,35.05 37.8,35.05 37.34,35.51 36.58,35.51 35.05,33.98 35.05,31.24 C4.1 | 29.26,23.62 v32.61,20.27 | 27.89,23.62 25.91,23.62 U1.20 25.76,23.62 23.93,23.62 22.55,22.25 22.55,20.27 | 27.89,23.62 29.26,23.62 | 22.55,20.27 22.55,14.02 R49.2 | 29.26,23.62 29.26,24.54 32.31,27.58 32.31,30.02 33.38,31.09 34.9,31.09 C4.1 | 27.89,23.62 v27.89,23.47 | 3.66,19.2 3.66,16 2.74,15.09 2.74,14.02 J13.2 | J6.1 3.66,19.2 | 3.66,19.2 4.72,20.27 10.06,20.27 J7.1 10.21,20.27 22.55,20.27
ACCEL_A0
  Top 0.152: 30.63,20.12 29.26,18.75 R16.2 | 30.63,20.12 30.79,20.27 31.7,20.27 U8.7 | 30.63,20.12 29.26,21.49 29.26,21.79 R15.2
GND  (via drill 0.35)
  Top 0.152: 34.29,4.12 34.29,6.1 J17.P2 34.44,6.25 34.44,8.08 36.42,10.06 36.42,10.97 35.97,11.43 U5.2 30.79,11.43 | 34.29,4.12 33.98,3.81 J17.P3 | J17.5 38.25,6.4 39.01,6.4 39.17,6.25 J17.P1 39.32,6.1 39.32,4.12 | 39.32,4.12 39.62,3.81 J17.P4 | 39.32,4.12 39.01,3.81 J17.P6 J17.P5 35.97,3.81 35.66,4.12 34.29,4.12 | 39.32,4.12 J17.P4 | 34.29,4.12 J17.P3 | J15.1 43.13,2.59 41,2.59 39.78,3.81 J17.P4 | J17.P3 30.48,3.81 J16.1 | C11.2 48.77,28.5 49.38,28.5 51.97,25.91 51.97,16.92 47.09,12.04 44.81,12.04 44.5,12.34 C7.2 44.35,12.5 43.89,12.95 41.91,12.95 | 30.79,11.43 29.57,10.21 C8.2 | 32,22.86 32,24.08 34.14,26.21 IC1.41 34.29,26.21 v35.2,27.13 | 32,22.86 32,21.64 U8.5 | 33.53,19.2 33.53,19.36 33.22,19.66 32.77,19.66 32.61,19.51 32.61,19.2 U8.10 32.46,19.05 32.46,18.75 30.79,17.07 | 33.53,19.2 33.98,19.2 U8.13 34.14,19.2 34.44,19.2 34.75,19.51 | 33.53,19.2 U8.12 | 34.75,19.51 34.75,20.57 34.59,20.73 34.29,20.73 U8.16 | 30.79,17.07 30.63,16.92 29.26,16.92 R16.1 29.11,16.92 28.19,17.83 28.19,22.71 28.35,22.86 32,22.86 | 30.79,17.07 30.79,11.43 | 41.91,12.95 40.23,12.95 39.17,11.89 37.34,11.89 37.19,12.04 37.19,12.8 38.71,14.33 38.71,16.15 35.36,19.51 34.75,19.51 | 41.91,12.95 R46.1 | C1.2 28.19,43.28 24.08,43.28 16.61,50.75 J12.3 | J14.1 12.65,2.59 7.62,2.59 5.18,5.03 H3.B3,0 5.03,5.18 2.44,7.77 2.44,11.43 J13.1 2.29,11.43 1.37,12.34 1.37,14.48 2.13,15.24 2.9,15.24 10.06,22.4 10.06,22.86 J7.2 | v83.06,34.9 84.43,34.9 85.04,34.29 J8.2 | 53.34,1.83 55.78,1.83 D7.C 55.93,1.83 58.37,1.83 D6.C 58.52,1.83 60.96,1.83 | 68.58,1.83 66.14,1.83 D3.C 65.99,1.83 63.55,1.83 D4.C 63.4,1.83 60.96,1.83
  Top 0.152: 68.58,1.83 71.02,1.83 D1.C 71.17,1.83 79.25,1.83 82.45,5.03 H4.B3,0 | 68.58,1.83 D2.C | 60.96,1.83 D5.C | v82.91,23.32 82.91,22.55 85.04,20.42 J10.2 | v62.03,30.79 62.03,31.85 62.18,32 R14.1 | 64.77,32.16 62.33,32.16 R14.1 | 64.77,32.16 67.21,32.16 R10.1 | 64.77,32.16 R12.1 | R14.1 62.18,32.16 57.76,32.16 47.4,42.52 47.4,43.13 J3.6 47.24,43.28 v47.24,44.81 | 22.86,32.16 20.42,32.16 R8.1 20.27,32.16 14.78,32.16 10.21,36.73 J5.2 | 22.86,32.16 25.3,32.16 R4.1 25.45,32.16 v27.13,32.16 | 22.86,32.16 R6.1 | v38.71,33.07 40.39,33.07 41.91,34.59 IC1.9 42.06,34.75 v43.28,35.97 | 32.16,35.36 32,35.51 32,36.42 32.31,36.73 35.05,36.73 35.51,36.27 IC1.20 35.66,36.12 36.27,35.51 36.42,35.51 v41.45,40.54 | 32.16,35.36 33.38,34.14 IC1.26 | J1.2 73.76,49.53 73.76,53.34 J4.2 | v28.8,33.83 30.63,33.83 32.16,35.36 | v52.12,2.44 52.73,2.44 53.34,1.83 | 53.34,1.83 D8.C
  Bottom 0.152: 21.49,7.62 21.03,8.08 20.12,8.08 U4.9 | U4.11 22.4,7.62 | 22.4,7.62 U4.3 | 22.4,7.62 22.4,11.43 R50.1 22.55,11.43 22.55,12.19 24.38,14.02 24.38,14.48 24.54,14.63 26.21,14.63 27.28,13.56 27.28,12.34 26.82,11.89 25.45,11.89 C10.2 25.45,11.73 25.45,8.69 C9.2 25.45,8.53 25.76,8.53 28.04,6.25 28.04,3.81 | 28.04,3.81 28.04,3.66 29.11,2.59 J16.1 | 35.66,27.58 35.97,27.28 C5.2 37.64,27.28 38.71,27.28 39.93,28.5 C6.2 40.08,28.65 41.3,29.87 41.3,30.94 C2.2 | 35.66,27.58 34.9,28.35 34.9,28.5 33.68,29.72 C4.2 | v35.2,27.13 35.66,27.58 | J12.3 16.46,50.9 15.54,50.9 14.48,51.97 6.25,51.97 H1.B3,0 5.03,50.75 5.03,48.62 1.37,44.96 1.37,37.95 2.44,36.88 J2.2 2.44,36.73 2.44,35.97 1.37,34.9 1.37,23.93 2.44,22.86 | 2.44,22.86 2.44,21.95 1.22,20.73 1.22,12.5 2.29,11.43 J13.1 | 2.44,22.86 J6.2 | 28.04,3.81 14.02,3.81 12.8,2.59 J14.1 | 81.53,24.69 83.82,26.98 83.82,33.07 85.04,34.29 J8.2 | 81.53,24.69 77.57,20.73 77.57,20.42 J11.2 | 78.64,34.29 82.45,34.29 v83.06,34.9 | 78.64,34.29 J9.2 | J10.2 79.4,14.63 79.4,13.72 81.38,11.73 81.38,6.25 H4.B3,0 | v82.91,23.32 81.53,24.69 | U2.10 61.87,29.72 61.87,30.63 v62.03,30.79 74.37,43.13 78.03,43.13 78.64,42.52 78.64,34.29 | U1.10 19.81,29.72 17.22,29.72 10.21,36.73 J5.2 | v38.71,33.07 37.95,33.07 37.49,33.53 C3.2 | J4.2 73.61,53.34 72.39,54.56 62.94,54.56 59.89,51.51 58.52,51.51 57.3,50.29 53.19,50.29 U3.7 53.03,50.14 50.75,50.14 46.33,45.72 | 46.33,45.72 41.45,40.84 v41.45,40.54 41.45,37.8 v43.28,35.97 | v28.8,33.83 v27.13,32.16 | H2.B3,0 82.45,50.9 76.96,50.9 76.81,51.05 75.29,51.05 73.76,49.53 J1.2 | 46.33,45.72 v47.24,44.81 | v52.12,2.44 43.28,2.44 J15.1
  other vias: 6.35,17.78 5.08,16.51 6.35,16.51 7.62,16.51 6.35,15.24 8.89,15.24 7.62,13.97 7.62,15.24 8.89,13.97 8.89,12.7 10.16,13.97 10.16,12.7 10.16,11.43 11.43,12.7 11.43,11.43 12.7,11.43 5.08,15.24 8.89,16.51 10.16,15.24 11.43,15.24 11.43,13.97 12.7,13.97 12.7,12.7 13.97,12.7 13.97,11.43 15.24,11.43 45.72,3.81 45.72,5.08 46.99,5.08 46.99,3.81 48.26,5.08 48.26,3.81 49.53,6.35 49.53,5.08 49.53,10.16 48.26,11.43 52.07,29.21 53.34,27.94 53.34,29.21 48.26,33.02 46.99,34.29 49.53,34.29 50.8,33.02 48.26,35.56 50.8,35.56 52.07,34.29 53.34,35.56 52.07,35.56 50.8,34.29 49.53,35.56 59.69,38.1 58.42,36.83 57.15,35.56 58.42,35.56 59.69,36.83 59.69,35.56 57.15,40.64 57.15,41.91 57.15,43.18 57.15,44.45 58.42,44.45 59.69,44.45 59.69,43.18 58.42,43.18 58.42,41.91 59.69,41.91 58.42,40.64 60.96,44.45 60.96,43.18 66.04,41.91 64.77,41.91 64.77,43.18 63.5,43.18 41.91,53.34 40.64,52.07 39.37,53.34 38.1,52.07 36.83,53.34 35.56,52.07 36.83,50.8 38.1,49.53 39.37,50.8 40.64,49.53 41.91,50.8 39.37,48.26 38.1,46.99 36.83,48.26 35.56,49.53 27.94,49.53 27.94,48.26 27.94,46.99 26.67,48.26 26.67,44.45 25.4,44.45 24.13,44.45 22.86,45.72 21.59,46.99 20.32,48.26 21.59,48.26 22.86,48.26 22.86,46.99 24.13,46.99 24.13,45.72 25.4,45.72 15.24,48.26 16.51,46.99 17.78,45.72 19.05,44.45 16.51,44.45 15.24,45.72 13.97,46.99 11.43,48.26 10.16,48.26 10.16,46.99 11.43,46.99 19.05,41.91 21.59,41.91 13.97,16.51 15.24,15.24 15.24,16.51 16.51,16.51 17.78,16.51 17.78,15.24 16.51,15.24 12.7,16.51 5.08,10.16 5.08,11.43 5.08,12.7 6.35,11.43 6.35,10.16 7.62,10.16 13.97,34.29 16.51,34.29 15.24,33.02 15.24,34.29 73.66,8.89 73.66,7.62 73.66,6.35 74.93,7.62 76.2,7.62 76.2,8.89 76.2,6.35 77.47,5.08 77.47,3.81 77.47,2.54 76.2,3.81 74.93,3.81 74.93,5.08 74.93,2.54
  pour Top: 0,0 0,55.88 87.25,55.88 87.25,0
  pour Bottom: 0,0 0,55.88 87.25,55.88 87.25,0
I2C_MUX1_A0  (via drill 0.35)
  Top 0.152: v26.67,33.07 26.21,33.07 25.45,33.83 R4.2 25.45,33.98 25.45,37.03 R3.2
  Bottom 0.152: v26.67,33.07 26.21,33.07 23.16,30.02 23.16,26.36 20.57,23.77 19.96,23.77 U1.1
I2C_MUX1_A1  (via drill 0.35)
  Top 0.152: v22.25,29.26 v22.25,27.74 | R6.2 22.86,33.98 22.25,34.59 v22.25,35.2 22.86,35.81 R5.2
  Bottom 0.152: v22.25,27.74 22.25,26.06 20.73,24.54 19.96,24.54 U1.2 | v22.25,35.2 v22.25,29.26
I2C_MUX1_A2  (via drill 0.35)
  Top 0.152: v24.08,35.05 24.08,33.38 23.77,33.07 21.18,33.07 20.42,33.83 R8.2 20.42,33.98 20.42,37.03 R7.2
  Bottom 0.152: v24.08,35.05 22.86,33.83 22.86,28.96 22.55,28.65 22.25,28.65 21.64,28.04 21.64,26.06 20.73,25.15 19.96,25.15 U1.3
I2C_MUX2_A0  (via drill 0.35)
  Top 0.152: v63.25,23.77 63.25,25.3 68.43,30.48 68.43,32.77 67.36,33.83 R10.2 67.36,33.98 67.36,37.03 R9.2
  Bottom 0.152: v63.25,23.77 61.87,23.77 U2.1
I2C_MUX2_A1  (via drill 0.35)
  Top 0.152: v63.86,24.54 63.86,25.45 68.73,30.33 68.73,37.49 68.12,38.1 65.68,38.1 64.77,37.19 R11.2 R12.2
  Bottom 0.152: v63.86,24.54 61.87,24.54 U2.2
I2C_MUX2_A2  (via drill 0.35)
  Top 0.152: v60.2,33.83 62.18,33.83 R14.2 62.33,33.98 62.33,37.03 R13.2
  Bottom 0.152: v60.2,33.83 56.54,33.83 54.71,32 54.71,26.67 56.24,25.15 61.72,25.15 U2.3
LED0  (via drill 0.35)
  Top 0.152: v37.49,24.84 37.49,24.54 36.73,23.77 IC1.48 | v48.77,19.2 v44.2,23.77
  Bottom 0.152: v37.49,24.84 37.8,24.84 38.56,25.6 42.37,25.6 v44.2,23.77 | v48.77,19.2 54.25,19.2 63.4,10.06 69.65,10.06 71.02,8.69 R17.2
LED1  (via drill 0.35)
  Top 0.152: v39.62,22.55 39.62,23.62 IC1.49 | v43.28,18.9 43.89,18.29 44.5,18.29 46.94,15.85 v48.46,15.85
  Bottom 0.152: v43.28,18.9 v39.62,22.55 | v48.46,15.85 49.38,15.85 54.25,10.97 62.03,10.97 63.25,9.75 67.51,9.75 68.58,8.69 R18.2
LED2  (via drill 0.35)
  Top 0.152: v42.06,21.95 39.93,24.08 IC1.50 | v44.2,19.81 45.87,18.14 v46.02,18.14
  Bottom 0.152: v44.2,19.81 v42.06,21.95 | v46.02,18.14 46.02,16 52.27,9.75 58.98,9.75 59.89,8.84 59.89,7.77 60.05,7.62 64.77,7.62 65.68,8.53 65.99,8.53 R19.2
LED3  (via drill 0.35)
  Top 0.152: v38.86,24.99 39.62,24.99 40.08,24.54 IC1.51 | v44.2,18.9 44.5,18.59 44.65,18.59 46.79,16.46 v47.24,16.46
  Bottom 0.152: v38.86,24.99 38.86,24.23 v44.2,18.9 | v47.24,16.46 47.24,15.7 52.58,10.36 61.72,10.36 63.4,8.69 R20.2
LED4  (via drill 0.35)
  Top 0.152: v42.06,23.32 40.69,24.69 IC1.52 | v46.02,19.05 v44.2,20.88
  Bottom 0.152: v42.06,23.32 42.06,23.01 v44.2,20.88 | v46.02,19.05 46.63,18.44 46.63,15.85 52.43,10.06 59.59,10.06 60.96,8.69 R21.2
LED5  (via drill 0.35)
  Top 0.152: v40.39,26.52 40.39,25.76 40.84,25.3 IC1.53 | v44.2,24.69 49.38,19.51 v49.38,16.76 | v54.56,11.58 54.56,10.21 v57.15,7.62
  Bottom 0.152: v40.39,26.52 42.37,26.52 v44.2,24.69 | v54.56,11.58 v49.38,16.76 | v57.15,7.62 57.45,7.62 58.37,8.53 R22.2
LED6  (via drill 0.35)
  Top 0.152: v47.09,12.95 42.67,17.37 42.67,24.08 41.3,25.45 IC1.54
  Bottom 0.152: v47.09,12.95 48.62,12.95 52.12,9.45 55.02,9.45 55.78,8.69 R23.2
LED7  (via drill 0.35)
  Top 0.152: v47.85,18.14 43.59,22.4 43.59,23.93 41.76,25.76 IC1.55
  Bottom 0.152: v47.85,18.14 47.85,15.54 52.73,10.67 61.87,10.67 63.09,9.45 66.9,9.45 67.06,9.3 67.06,7.77 66.9,7.62 65.23,7.62 64.62,7.01 64.62,5.64 63.86,4.88 55.63,4.88 54.41,6.1 54.41,7.47 53.34,8.53 R24.2
MISO  (via drill 0.35)
  Top 0.152: v30.63,29.72 31.24,29.11 IC1.33 | v45.72,52.88 62.94,52.88 63.4,53.34 J4.6
  Bottom 0.152: v30.63,29.72 30.63,32.46 30.18,32.92 30.18,37.34 v45.72,52.88 | U3.10 58.83,48.92 59.44,48.92 63.4,52.88 63.4,53.34 J4.6
MOSI  (via drill 0.35)
  Top 0.152: v30.79,27.74 31.7,28.65 IC1.34 | v59.59,52.12 64.77,52.12 65.99,53.34 J4.5
  Bottom 0.152: v30.79,27.74 30.79,28.5 32,29.72 32,34.59 35.2,37.8 35.2,39.93 47.4,52.12 v59.59,52.12 | U3.11 58.83,48.31 60.96,48.31 65.99,53.34 J4.5
MUX1_SC0  (via drill 0.35)
  Top 0.152: v11.58,26.98 v13.56,26.98 | R30.2 6.25,44.2 2.74,44.2 2.59,44.35 J2.5
  Bottom 0.152: v13.56,26.98 19.81,26.98 U1.6 | v11.58,26.98 10.97,26.98 10.67,26.67 9.75,26.67 4.42,32 4.42,42.52 2.59,44.35 J2.5
MUX1_SC1
  Top 0.152: R32.2 13.87,44.2 10.36,44.2 10.21,44.35 J5.5
  Bottom 0.152: J5.5 7.16,41.45 7.16,31.7 9.6,29.26 10.52,29.26 10.82,28.96 19.81,28.96 U1.9
MUX1_SC2  (via drill 0.35)
  Top 0.152: v23.77,28.19 22.71,27.13 17.83,27.13 v15.39,29.57 | v8.84,31.85 8.08,31.85 6.4,30.18 R34.2 6.25,30.18 5.94,30.48 J6.5
  Bottom 0.152: v23.77,28.19 25.76,28.19 U1.13 | v15.39,29.57 12.8,29.57 10.52,31.85 v8.84,31.85
MUX1_SC3
  Top 0.152: R36.2 13.87,30.18 10.52,30.18 10.21,30.48 J7.5
  Bottom 0.152: J7.5 9.3,30.48 7.47,32.31 7.47,41 9.6,43.13 24.99,43.13 29.72,38.41 29.72,28.19 27.89,26.36 25.91,26.36 U1.16
MUX1_SD0  (via drill 0.35)
  Top 0.152: v12.5,26.21 v15.09,26.21 | R29.2 6.25,39.17 5.33,39.17 2.59,41.91 J2.4
  Bottom 0.152: v15.09,26.21 19.81,26.21 U1.5 | v12.5,26.21 11.43,25.15 11.43,24.99 10.67,24.23 9.6,24.23 4.12,29.72 4.12,40.39 2.59,41.91 J2.4
MUX1_SD1
  Top 0.152: R31.2 13.87,39.17 12.95,39.17 10.21,41.91 J5.4
  Bottom 0.152: U1.8 19.96,28.35 20.73,28.35 21.03,28.65 21.03,31.09 10.21,41.91 J5.4
MUX1_SD2  (via drill 0.35)
  Top 0.152: v27.13,28.8 27.13,28.35 24.54,25.76 24.54,20.73 v21.95,18.14 | R33.2 6.4,24.99 7.47,23.93 7.47,22.55 5.64,20.73 v5.64,19.66 5.03,19.05 2.13,19.05 1.37,19.81 1.37,25.91 2.44,26.98 2.44,27.89 J6.4
  Bottom 0.152: v27.13,28.8 25.91,28.8 U1.12 | v21.95,18.14 7.16,18.14 v5.64,19.66
MUX1_SD3
  Top 0.152: R35.2 13.87,25.15 12.5,25.15 10.21,27.43 10.21,27.89 J7.4
  Bottom 0.152: U1.15 25.76,26.98 24.54,26.98 20.42,22.86 15.7,22.86 13.11,25.45 13.11,26.52 11.73,27.89 10.21,27.89 J7.4
MUX2_SC0
  Top 0.152: R38.2 81.38,41.6 84.73,41.6 85.04,41.91 J8.5
  Bottom 0.152: U2.6 61.72,26.98 56.54,26.98 56.24,26.67 55.63,26.67 55.32,26.98 55.32,27.58 71.17,43.43 83.52,43.43 85.04,41.91 J8.5
MUX2_SC1
  Top 0.152: R40.2 73.76,41.6 77.11,41.6 77.42,41.91 J9.5
  Bottom 0.152: J9.5 77.11,41.91 64.16,28.96 61.87,28.96 U2.9
MUX2_SC2  (via drill 0.35)
  Top 0.152: J10.5 84.89,27.74 81.38,27.74 R42.2 81.23,27.74 81.23,28.5 v80.31,29.41 | v34.59,23.93 32.61,21.95 32.61,21.64 U8.4 | v42.67,29.72 44.04,29.72 44.35,30.02 46.48,30.02 48.16,31.7 60.2,31.7 62.79,29.11 v66.14,29.11
  Bottom 0.152: v34.59,23.93 35.66,23.93 38.71,26.98 39.93,26.98 v42.67,29.72 | U2.13 67.67,28.35 66.9,28.35 v66.14,29.11 66.14,29.41 66.75,30.02 68.73,30.02 69.34,29.41 v80.31,29.41
MUX2_SC3
  Top 0.152: J11.5 77.27,27.74 73.76,27.74 R44.2
  Bottom 0.152: J11.5 75.89,26.36 67.82,26.36 U2.16
MUX2_SD0  (via drill 0.35)
  Top 0.152: v78.49,44.04 78.49,43.59 80.16,41.91 80.16,40.84 80.31,40.69 82.3,40.69 | 82.3,40.69 83.82,40.69 85.04,39.47 J8.4 | 82.3,40.69 82.3,38.86 81.38,37.95 81.38,36.58 R37.2
  Bottom 0.152: v78.49,44.04 71.32,44.04 55.02,27.74 55.02,26.82 55.47,26.36 61.72,26.36 U2.5
MUX2_SD1
  Top 0.152: J9.4 74.68,36.58 73.76,36.58 R39.2
  Bottom 0.152: U2.8 61.87,28.35 64.01,28.35 74.98,39.32 77.42,39.32 J9.4
MUX2_SD2  (via drill 0.35)
  Top 0.152: v30.94,20.88 31.7,20.88 U8.6 | v44.2,16.76 45.11,16.76 46.94,14.94 48.92,14.94 51.36,17.37 v51.36,24.84 | v60.5,24.54 61.57,24.54 62.94,23.16 63.55,23.16 68.73,28.35 v69.04,28.35 71.17,28.35 72.85,26.67 77.88,26.67 81.23,23.32 81.23,22.55 R41.2 81.23,22.4 80.92,22.1 v79.86,22.1
  Bottom 0.152: v30.94,20.88 33.83,17.98 42.98,17.98 v44.2,16.76 | v51.36,24.84 60.2,24.84 v60.5,24.54 | v69.04,28.35 68.58,28.8 67.82,28.8 U2.12 | v79.86,22.1 82.6,22.1 85.04,24.54 85.04,25.3 J10.4
MUX2_SD3
  Top 0.152: R43.2 73.76,22.55 74.68,22.55 77.42,25.3 J11.4
  Bottom 0.152: U2.15 67.82,27.13 74.98,27.13 76.96,29.11 79.7,29.11 80.01,28.8 80.01,27.89 77.57,25.45 J11.4
N$1
  Top 0.152: R1.2 26.36,50.75 28.8,50.75 33.98,45.57 S1.B2 33.98,45.41 33.38,44.81 33.38,43.28 R2.2
N$2
  Top 0.152: C1.1 30.02,43.28 30.02,44.96 29.57,45.41 S1.A2
N$3  (via drill 0.35)
  Top 0.152: v45.57,39.47 45.57,42.82 45.26,43.13 J3.8
  Bottom 0.152: v45.57,39.47 46.48,38.56 46.94,38.56 R26.2
N$4  (via drill 0.35)
  Top 0.152: v52.12,41.76 52.73,42.37 52.73,43.13 J3.1
  Bottom 0.152: v52.12,41.76 52.12,40.39 R25.2
N$5  (via drill 0.35)
  Top 0.152: v71.17,5.49 71.17,3.96 D1.A
  Bottom 0.152: v71.17,5.49 71.17,6.55 R17.1
N$6  (via drill 0.35)
  Top 0.152: v36.12,7.92 36.12,6.55 J17.2
  Bottom 0.152: v36.12,7.92 36.12,8.69 35.66,9.14 R47.1
N$7  (via drill 0.35)
  Top 0.152: v68.58,5.49 D2.A
  Bottom 0.152: R18.1 v68.58,5.49
N$8
  Top 0.152: D9.C 42.06,7.62 42.06,7.92 38.41,11.58 37.19,11.58 36.88,11.89 36.88,14.48 37.64,15.24 R45.1
N$9
  Bottom 0.152: U4.10 20.12,10.97 20.57,11.43 R50.2 20.73,11.43 20.73,13.87 R49.1
N$10  (via drill 0.35)
  Top 0.152: v66.14,5.49 66.14,3.96 D3.A
  Bottom 0.152: v66.14,5.49 66.14,6.55 R19.1
N$11  (via drill 0.35)
  Top 0.152: v63.55,5.49 63.55,3.96 D4.A
  Bottom 0.152: v63.55,5.49 63.55,6.55 R20.1
N$12  (via drill 0.35)
  Top 0.152: v60.96,5.49 D5.A
  Bottom 0.152: R21.1 v60.96,5.49
N$13  (via drill 0.35)
  Top 0.152: v58.52,5.49 58.52,3.96 D6.A
  Bottom 0.152: v58.52,5.49 58.52,6.55 R22.1
N$14  (via drill 0.35)
  Top 0.152: v55.93,5.49 55.93,3.96 D7.A
  Bottom 0.152: v55.93,5.49 55.93,6.55 R23.1
N$15  (via drill 0.35)
  Top 0.152: v53.34,5.49 D8.A
  Bottom 0.152: R24.1 v53.34,5.49
N$16
  Top 0.152: U5.1 35.66,12.5 35.66,15.09 35.81,15.24 R45.2
N$17  (via drill 0.35)
  Top 0.152: v37.03,8.08 36.88,7.92 36.88,6.55 J17.3
  Bottom 0.152: v37.03,8.08 38.1,9.14 R48.1
N$18
  Bottom 0.152: U4.4 23.16,7.01 23.62,7.01 23.77,6.86 23.77,5.79 23.32,5.33 20.42,5.33 16.15,9.6 16.15,10.06 16,10.21 11.89,10.21 11.73,10.06 11.73,8.23 13.87,6.1 U$1.2
N$19
  Top 0.152: U5.5 38.25,12.5 39.32,12.5 41.6,14.78 41.91,14.78 R46.2
N$20
  Bottom 0.152: U4.2 23.16,8.08 24.08,8.08 24.54,7.62 26.21,7.62 26.52,7.32 26.52,5.94 25.45,4.88 18.44,4.88 14.33,8.99 14.02,8.99 U$1.1
PGEC1
  Top 0.152: IC1.17 36.73,37.34 36.73,39.47 37.95,40.69 37.95,43.89 29.72,52.12 17.37,52.12 17.22,52.27 12.8,52.27 11.43,50.9 J12.5
PGED1
  Top 0.152: J12.4 24.84,39.93 33.22,39.93 36.27,36.88 IC1.18
RGB_DIN
  Top 0.152: IC1.11 41.3,35.51 43.59,37.8 44.2,37.8 45.72,36.27 45.72,32.16 44.2,30.63 27.13,30.63 20.57,24.08 9.6,24.08 6.25,20.73 6.25,19.36 3.5,16.61 2.44,16.61 J13.3
SCK  (via drill 0.35)
  Top 0.152: v29.11,28.5 30.48,27.13 31.09,27.13 31.39,27.43 31.39,27.74 32,28.35 IC1.35 | v30.79,36.73 v29.11,35.05 | v44.96,50.6 64.92,50.6 66.45,52.12 67.36,52.12 J4.4
  Bottom 0.152: v29.11,28.5 29.11,31.39 29.41,31.7 29.41,34.75 v29.11,35.05 | v30.79,36.73 31.39,36.73 44.96,50.29 v44.96,50.6 | J4.4 68.12,53.34 62.48,47.7 58.83,47.7 U3.12
SCL1  (via drill 0.35)
  Top 0.152: 30.33,25.15 v28.04,25.15 | 30.33,25.15 32.77,27.58 IC1.37 | v64.47,23.16 v66.29,24.99 | v62.48,41.91 62.48,45.72 R28.2 62.64,45.72 65.99,49.07 65.99,49.53 J1.5 | 30.33,25.15 30.33,24.99 v30.48,24.84 | v44.2,17.68 44.65,17.68 47.09,15.24 48.77,15.24 50.44,16.92 v50.44,24.84
  Bottom 0.152: v28.04,25.15 25.91,25.15 U1.18 | v66.29,24.99 67.67,24.99 U2.18 | v64.47,23.16 59.59,23.16 58.52,24.23 51.05,24.23 50.75,24.54 50.75,24.84 | 50.75,24.84 50.75,30.18 v62.48,41.91 | v30.48,24.84 32.77,24.84 39.32,18.29 43.59,18.29 v44.2,17.68 | 50.75,24.84 v50.44,24.84
SD_!SS  (via drill 0.35)
  Top 0.152: v51.66,46.33 51.66,43.28 J3.2
  Bottom 0.152: v51.66,46.33 52.27,46.94 53.03,46.94 U3.2
SD_MISO  (via drill 0.35)
  Top 0.152: v50.29,48.77 46.33,44.81 46.33,43.28 J3.7
  Bottom 0.152: v50.29,48.77 53.03,48.77 U3.5
SD_MOSI  (via drill 0.35)
  Top 0.152: v51.66,48.16 51.66,47.24 50.75,46.33 50.75,43.28 J3.3
  Bottom 0.152: v51.66,48.16 53.03,48.16 U3.4
SD_SCK  (via drill 0.35)
  Top 0.152: v49.07,44.65 49.07,44.35 48.46,43.74 48.46,43.28 J3.5
  Bottom 0.152: v49.07,44.65 51.97,47.55 53.03,47.55 U3.3
SDA1  (via drill 0.35)
  Top 0.152: v30.33,26.52 30.94,26.52 32.31,27.89 IC1.36 | v79.4,28.5 79.4,41.76 72.85,48.31 69.8,48.31 | 69.8,48.31 J1.4 67.36,50.75 65.53,50.75 64.31,49.53 v43.28,49.53 | 69.8,48.31 67.67,46.18 67.67,45.72 R27.2 | v31.39,37.64 v31.39,35.51
  Bottom 0.152: U1.19 25.91,24.54 28.35,24.54 v30.33,26.52 30.33,27.28 30.18,27.43 30.18,28.35 31.39,29.57 v31.39,35.51 | v79.4,28.5 79.4,28.19 77.88,26.67 76.96,26.67 74.83,24.54 67.82,24.54 U2.19 | v43.28,49.53 v31.39,37.64
U1CTS  (via drill 0.35)
  Top 0.152: v32.61,36.12 32.77,36.12 34.14,34.75 IC1.24 | v30.79,33.22 30.02,33.22 v28.8,32 | v27.13,29.72 24.23,26.82 24.23,20.88 22.1,18.75 21.64,18.75 19.05,16.15 19.05,2.13 18.29,1.37 16.31,1.37 15.24,2.44 J14.2
  Bottom 0.152: v32.61,36.12 31.09,36.12 30.79,35.81 v30.79,33.22 | v28.8,32 28.8,31.39 v27.13,29.72
U1RX
  Top 0.152: IC1.22 35.05,35.36 36.12,34.29 37.19,34.29 38.56,35.66 38.56,36.88 39.93,38.25 44.2,38.25 46.02,36.42 46.02,32 44.35,30.33 29.57,30.33 24.84,25.6 24.84,8.69 20.42,4.27 20.42,2.59 J14.4
U1TX  (via drill 0.35)
  Top 0.152: v36.88,34.9 36.12,34.9 35.36,35.66 IC1.21
  Bottom 0.152: v36.88,34.9 37.49,34.9 38.71,33.68 40.23,33.68 44.81,29.11 44.81,5.03 43.59,3.81 32.16,3.81 29.72,1.37 23.93,1.37 22.86,2.44 J14.5
V_BATT
  Top 0.152: U5.3 35.51,10.36 31.7,10.36 31.55,10.21 C8.1 31.39,10.06 31.39,7.32 29.26,5.18 J16.2
VBATT  (via drill 0.35)
  Top 0.152: v23.01,5.94 23.93,5.94 v24.38,5.49
  Bottom 0.152: v23.01,5.94 23.01,6.55 U4.5 | v24.38,5.49 25.45,6.55 C9.1
VCAP  (via drill 0.35)
  Top 0.152: v46.79,26.52 47.7,27.43 C11.1 | v46.18,25.3 42.98,25.3 42.06,26.21 IC1.56
  Bottom 0.152: v46.79,26.52 46.79,25.91 v46.18,25.3
VCC_USB
  Top 0.152: J17.1 35.51,6.55 35.51,8.23 37.64,10.36 38.1,10.36 U5.4 38.25,10.36 38.25,9.91 41.91,6.25 43.28,6.25 | C7.1 44.35,10.36 44.35,7.62 D9.A 44.2,7.62 44.2,7.16 43.28,6.25 | 43.28,6.25 43.28,5.18 J15.2

### Text on the board
tNames: H.A.L.O. / Main Board / Hunter Hykes / 2021/01/12
tSilk: ▼